# EasyEDA Pro project YuriPre2.0.eprj

# Schematic Schematic1

## Sheets
1 P1: Create Date: 2022-05-23; Project Name: YuriPre2.0; Schematic Name: Schematic1; Update Date: 2022-05-24
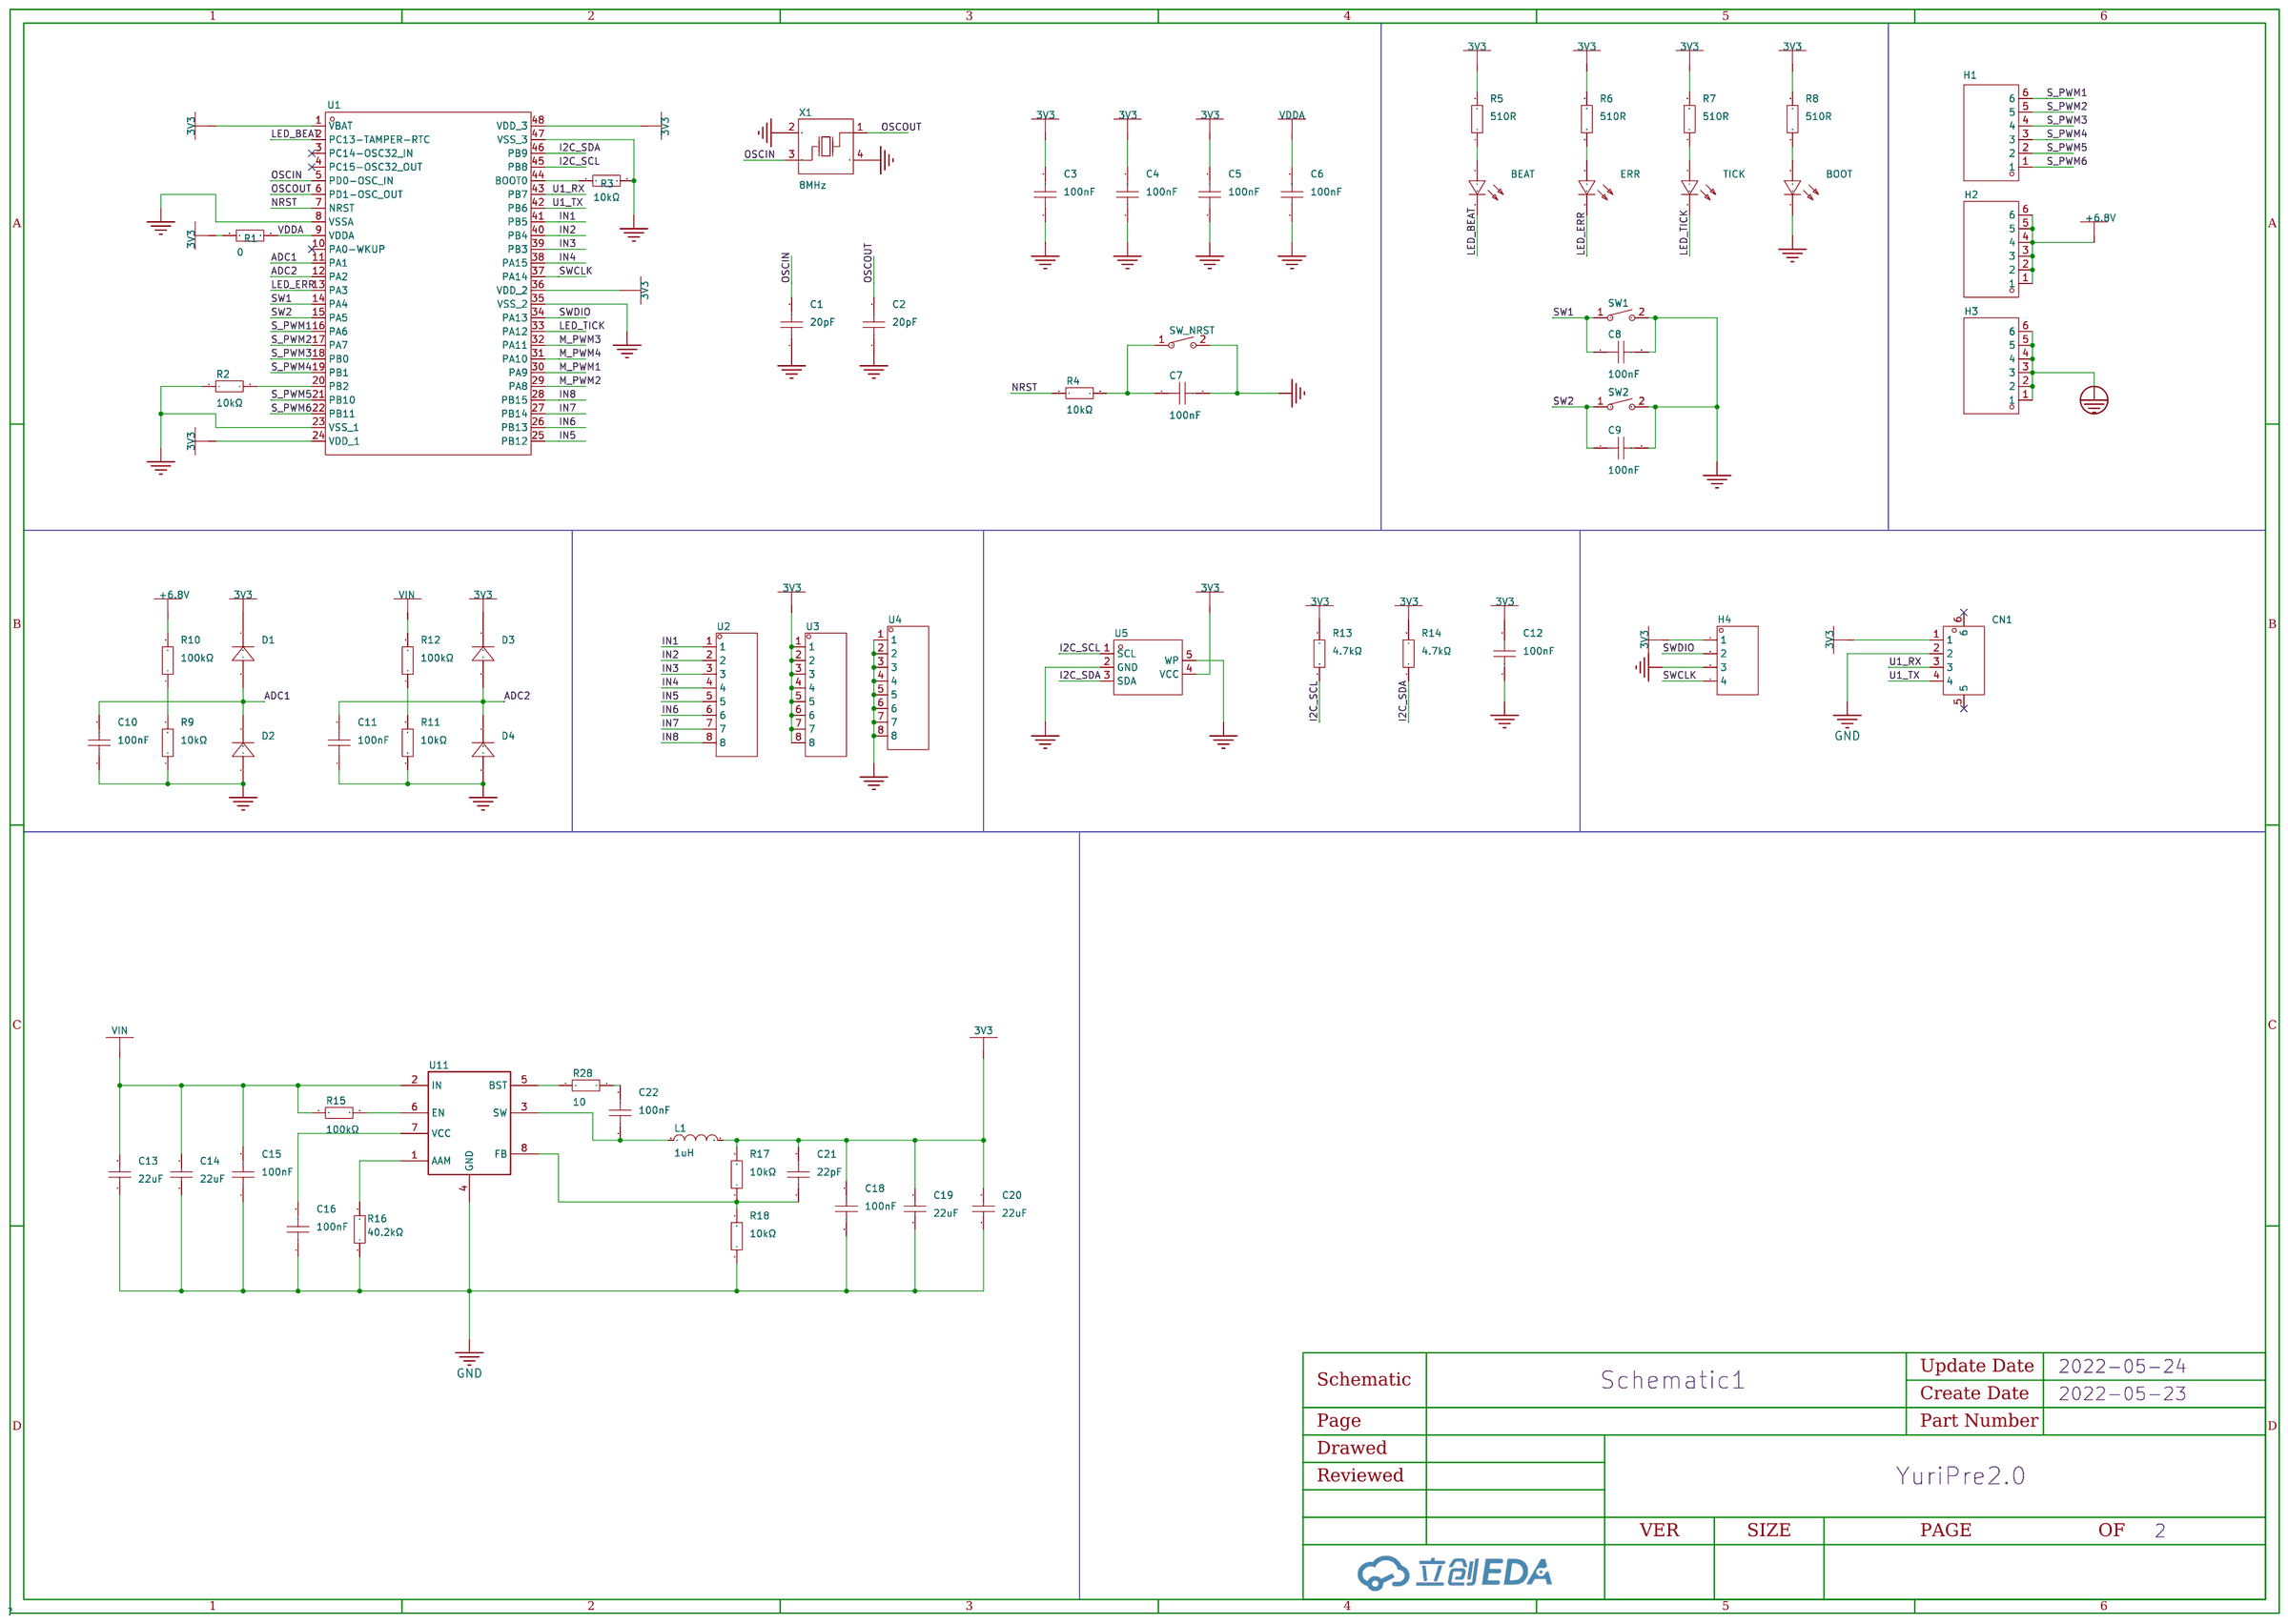
[diagram p0: P1]
2 P2: Create Date: 2022-05-24; Page Name: P2
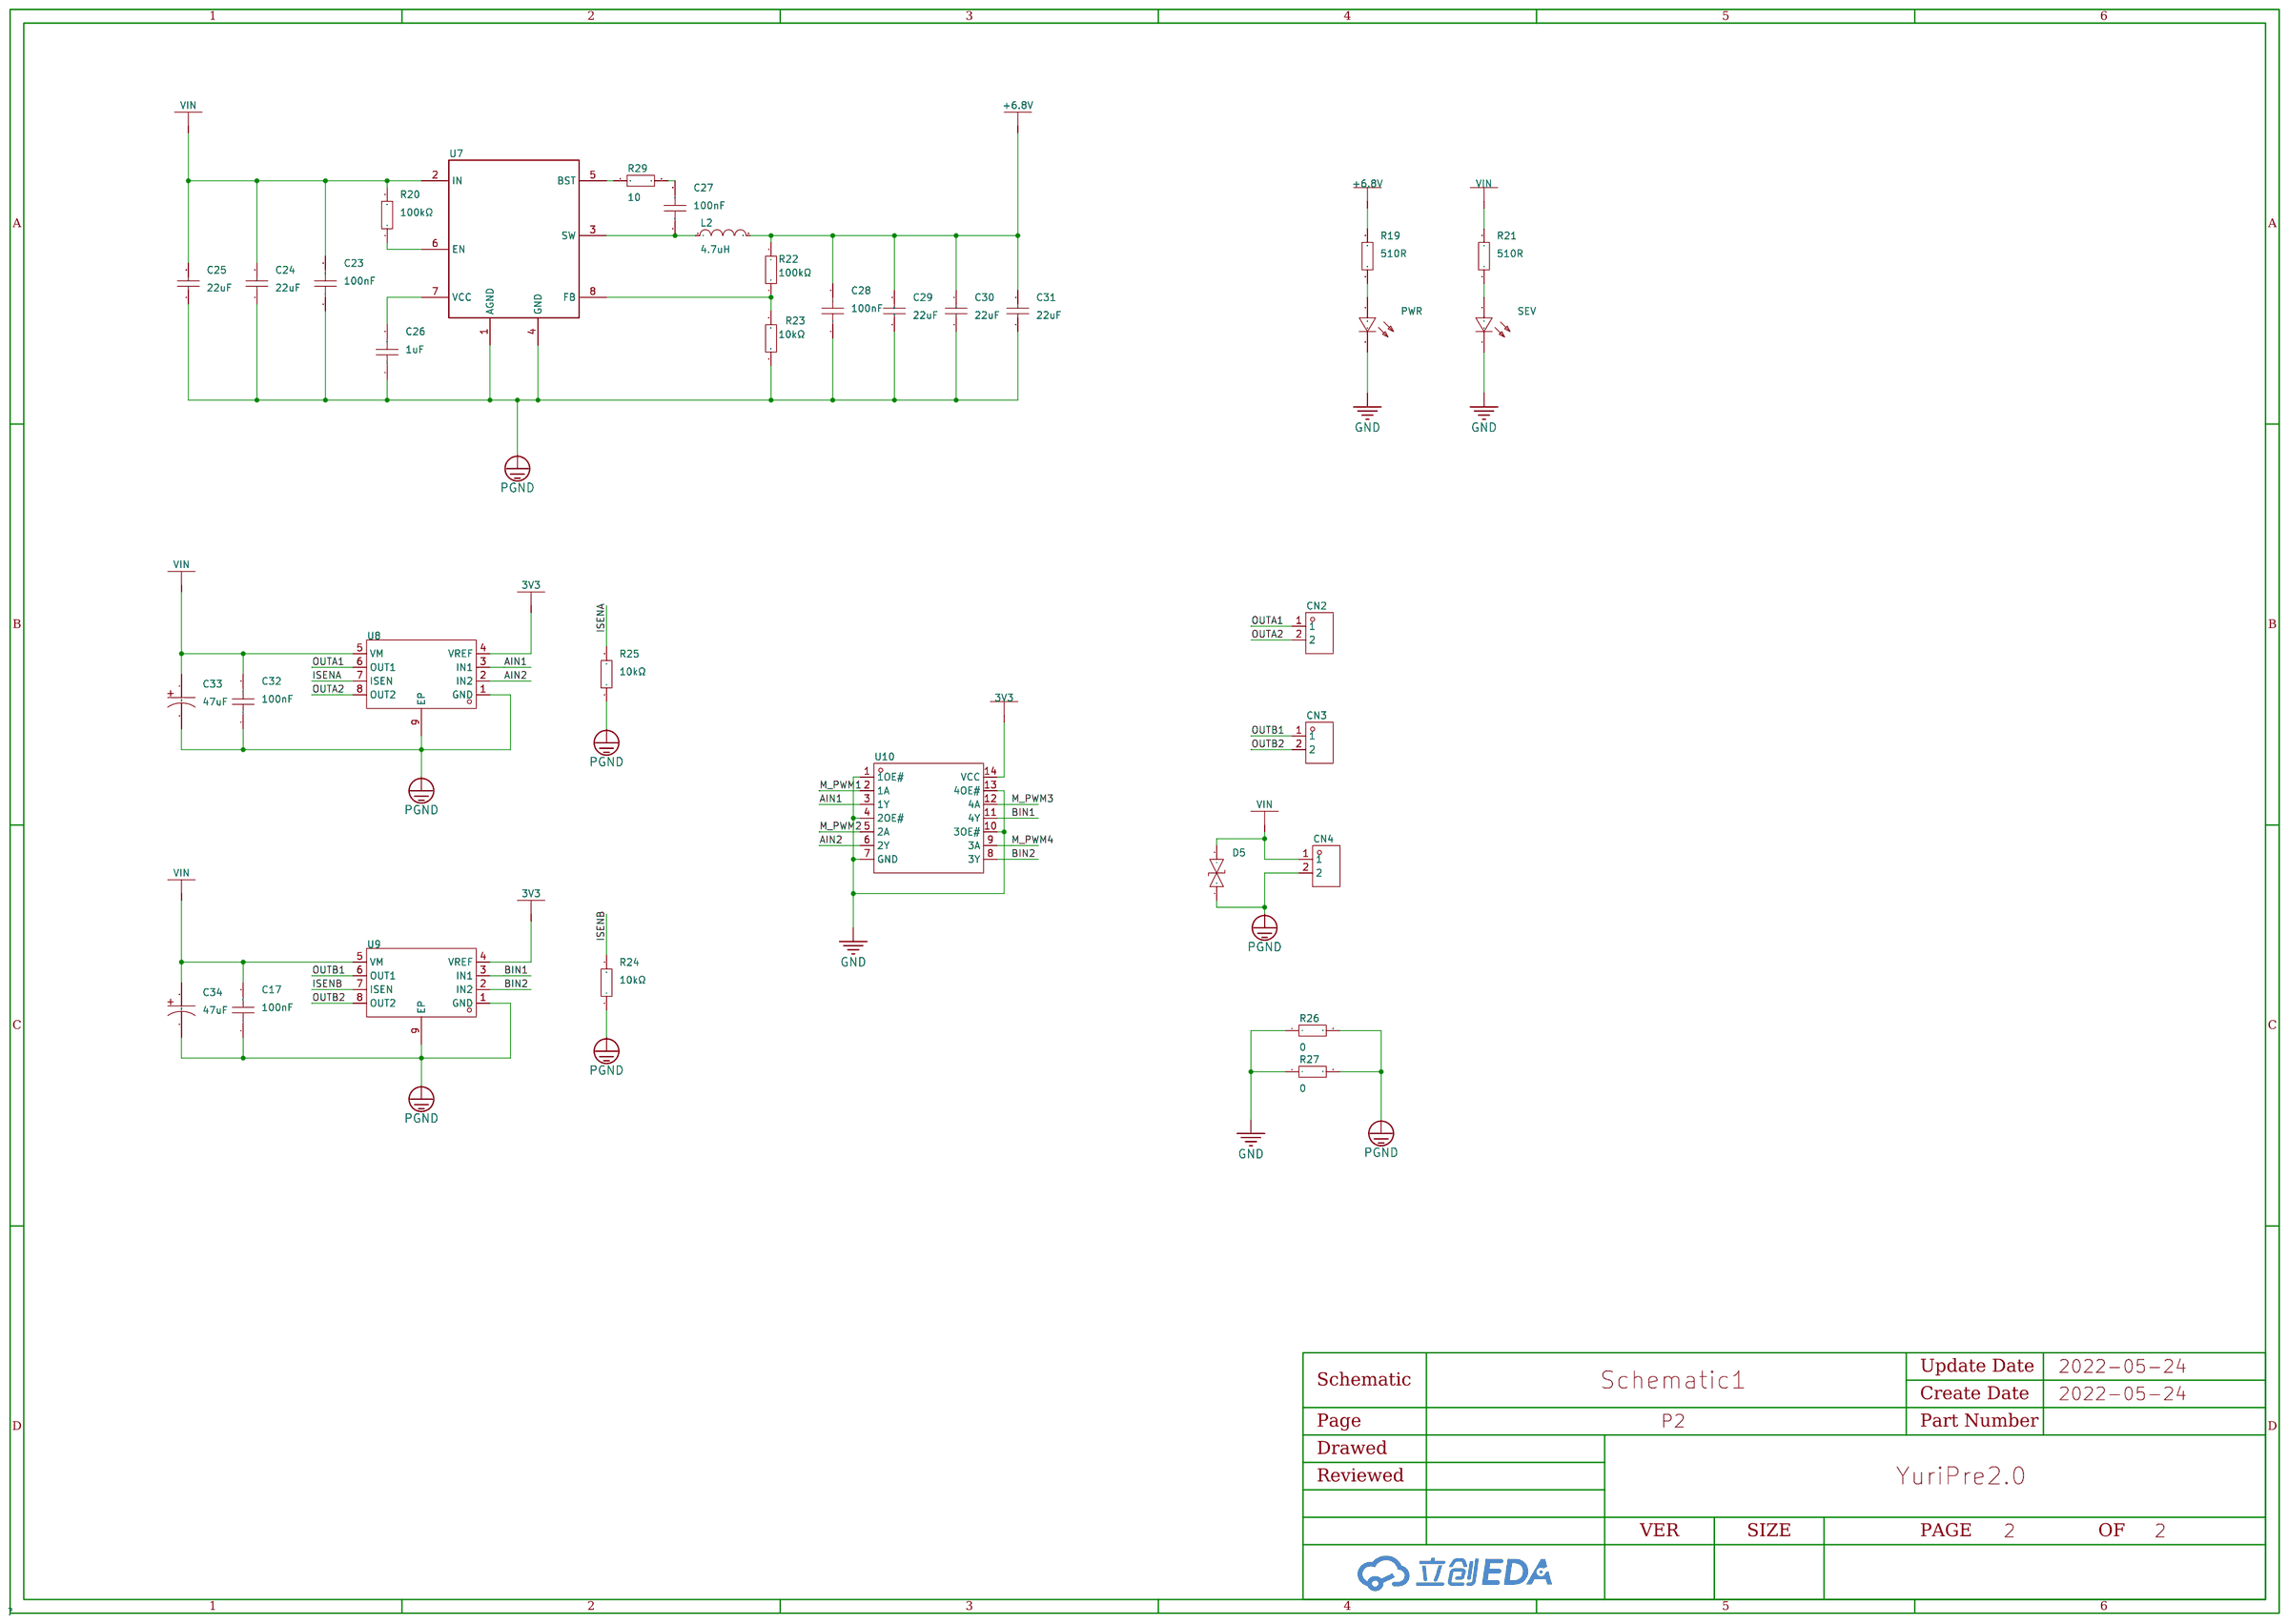
[diagram p1: P2]

## Parts
sheet P1
BEAT  -  [LED0603-R-RD]
BOOT  -  [LED0603-R-RD]
C1  20pF  [C0402]
C2  20pF  [C0402]
C3  100nF  [C0402]
C4  100nF  [C0402]
C5  100nF  [C0402]
C6  100nF  [C0402]
C7  100nF  [C0402]
C8  100nF  [C0402]
C9  100nF  [C0402]
C10  100nF  [C0402]
C11  100nF  [C0402]
C12  100nF  [C0402]
C13  22uF  [C0805]
C14  22uF  [C0805]
C15  100nF  [C0603]
C16  100nF  [C0603]
C18  100nF  [C0603]
C19  22uF  [C0805]
C20  22uF  [C0805]
C21  22pF  [C0402]
C22  100nF  [C0603]
CN1  -  [CONN-SMD_4P-1.25P_1.25T-4P]
D1  -  [SOD-123FL_L2.6-W1.6-LS3.4-R-FD]
D2  -  [SOD-123FL_L2.6-W1.6-LS3.4-R-FD]
D3  -  [SOD-123FL_L2.6-W1.6-LS3.4-R-FD]
D4  -  [SOD-123FL_L2.6-W1.6-LS3.4-R-FD]
ERR  -  [LED0603-R-RD]
H1  -  [HDR-TH_6P-P2.54-V_Z-211-0611-0021-001]
H2  -  [HDR-TH_6P-P2.54-V_Z-211-0611-0021-001]
H3  -  [HDR-TH_6P-P2.54-V_Z-211-0611-0021-001]
H4  -  [HDR-TH_4P-P2.54-V-M]
L1  1uH  [IND-SMD_L2.5-W2.0-1]
R1  0  [R0402]
R2  10kΩ  [R0402]
R3  10kΩ  [R0402]
R4  10kΩ  [R0402]
R5  510R  [R0402]
R6  510R  [R0402]
R7  510R  [R0402]
R8  510R  [R0402]
R9  10kΩ  [R0402]
R10  100kΩ  [R0402]
R11  10kΩ  [R0402]
R12  100kΩ  [R0402]
R13  4.7kΩ  [R0402]
R14  4.7kΩ  [R0402]
R15  100kΩ  [R0402]
R16  40.2kΩ  [R0402]
R17  10kΩ  [R0402]
R18  10kΩ  [R0402]
R28  10  [R0603]
SW1  -  [SW-SMD_L4.0-W2.9-LS5.0]
SW2  -  [SW-SMD_L4.0-W2.9-LS5.0]
SW_NRST  -  [SW-SMD_L4.0-W2.9-LS5.0]
TICK  -  [LED0603-R-RD]
U1  -  [LQFP-48_L7.0-W7.0-P0.50-LS9.0-BL]
U2  -  [HDR-TH_8P-P2.54-V-M]
U3  -  [HDR-TH_8P-P2.54-V-M]
U4  -  [HDR-TH_8P-P2.54-V-M]
U5  -  [SOT-23-5_L3.0-W1.7-P0.95-LS2.8-BL]
U11  -  [TSOT23-8_L2.9-W1.6-P0.65-LS2.8-TL]
X1  8MHz  [CRYSTAL-SMD_4P-L3.2-W2.5-BL]
sheet P2
C17  100nF  [C0603]
C23  100nF  [C0603]
C24  22uF  [C0805]
C25  22uF  [C0805]
C26  1uF  [C0603]
C27  100nF  [C0603]
C28  100nF  [C0603]
C29  22uF  [C0805]
C30  22uF  [C0805]
C31  22uF  [C0805]
C32  100nF  [C0603]
C33  47uF  [CAP-TH_BD5.0-P2.00-D0.8-FD]
C34  47uF  [CAP-TH_BD5.0-P2.00-D0.8-FD]
CN2  -  [CONN-TH_OQ0232510000G]
CN3  -  [CONN-TH_OQ0232510000G]
CN4  -  [CONN-TH_OQ0232510000G]
D5  -  [SOD-123_L2.8-W1.8-LS3.7-BI]
L2  4.7uH  [IND-SMD_L5.7-W5.4]
PWR  -  [LED0603-R-RD]
R19  510R  [R0402]
R20  100kΩ  [R0402]
R21  510R  [R0402]
R22  100kΩ  [R0402]
R23  10kΩ  [R0402]
R24  10kΩ  [R0603]
R25  10kΩ  [R0603]
R26  0  [R0603]
R27  0  [R0603]
R29  10  [R0603]
SEV  -  [LED0603-R-RD]
U7  -  [TSOT23-8_L2.9-W1.6-P0.65-LS2.8-TL]
U8  -  [SOP-8_L4.9-W3.9-P1.27-LS6.0-BL-EP]
U9  -  [SOP-8_L4.9-W3.9-P1.27-LS6.0-BL-EP]
U10  -  [TSSOP-14_L5.0-W4.4-P0.65-LS6.5-BL]

## Library data of the parts
BEAT BOOT ERR PWR SEV TICK = 19-217/GHC-YR1S2/3T: 发光颜色:翠绿;二极管配置:-;透镜颜色:无色透明;主波长:520nm~535nm;峰值波长:518nm;色温:-;光通量(25时):-;测试电流:20mA;正向电压(VF):3.3V;发光强度:285mcd;功率:110mW;发光角度:120°;安装方式:-;工作温度:-40~+85;; LCSC Part Name: 翠绿LED; Supplier Part: C72043; Manufacturer: EVERLIGHT(台湾亿光); Supplier Footprint: 0603; JLCPCB Part Class: Basic Part; Datasheet: https://atta.szlcsc.com/upload/public/pdf/source/20160507/1462613613780.pdf; Supplier: LCSC; Emitted Color: 翠绿; Lens Color: 无色透明; Dominant Wavelength: 520nm~535nm; Peak Wavelength: 518nm; Forward Current: 20mA; Forward Voltage (VF): 3.3V; Luminous Intensity: 285mcd; Power Dissipation: 110mW; Viewing Angle: 120°; Operating Temperature: -40~+85
C1-C12 C21 = FN15X104K250PNG: 容值:100nF;精度:±10%;额定电压:25V;温度系数:X7R;; LCSC Part Name: 100nF ±10% 25V; Supplier Part: C525225; Manufacturer: PSA(信昌电陶); Supplier Footprint: 0402; JLCPCB Part Class: Extended Part; Datasheet: https://atta.szlcsc.com/upload/public/pdf/source/20200506/C436246_4EAA78C9048D88437BAF2CB7B8BE45FD.pdf; Supplier: LCSC; Tolerance: ±10%; Voltage Rated: 25V; Temperature Coefficient: X7R
C13 C14 C19 C20 C24 C25 C29-C31 = CC0805KRX7R9BB104: 容值:100nF;精度:±10%;额定电压:50V;温度系数:X7R;; LCSC Part Name: 100nF ±10% 50V; Supplier Part: C49678; Manufacturer: YAGEO(国巨); Supplier Footprint: 0805; JLCPCB Part Class: Basic Part; Datasheet: https://atta.szlcsc.com/upload/public/pdf/source/20151026/1457707504898.pdf; Supplier: LCSC; Tolerance: ±10%; Voltage Rated: 50V; Temperature Coefficient: X7R
C15-C18 C22 C23 C26-C28 C32 = CC0603KRX7R9BB104: 容值:100nF;精度:±10%;额定电压:50V;温度系数:X7R;; LCSC Part Name: 100nF ±10% 50V; Supplier Part: C14663; Manufacturer: YAGEO(国巨); Supplier Footprint: 0603; JLCPCB Part Class: Basic Part; Datasheet: https://atta.szlcsc.com/upload/public/pdf/source/20170116/1484561234239.pdf; Supplier: LCSC; Tolerance: ±10%; Voltage Rated: 50V; Temperature Coefficient: X7R
CN1 = 1.25T-4P-WT: 参考系列:-;间距:1.25mm;插针结构:1x4P;排数:1;每排PIN数:4;行距:-;安装方式:-;触头材质:磷青铜;; Supplier Part: C125739; Manufacturer: 韩国韩荣; Supplier Footprint: SMD,P=1.25mm; JLCPCB Part Class: Extended Part; Datasheet: https://atta.szlcsc.com/upload/public/pdf/source/20200721/C707315_EB981FF53C07D03444DA83DA11F0005F.pdf; Supplier: LCSC; Pitch: 1.25mm; Pins Structure: 1x4P; Number of Rows: 1; Number of PINs Per Row: 4; Contact Material: 磷青铜
D1-D4 = 1N4148W D1: 二极管配置:独立式;功率:400mW;直流反向耐压(Vr):75V;平均整流电流(Io):150mA;正向压降(Vf):1V@10mA;反向电流(Ir):5A@75V;反向恢复时间(trr):4ns;工作温度:+150@(Tj);; LCSC Part Name: 75V 150mA 4ns; Supplier Part: C129216; Manufacturer: TC(德昌); Supplier Footprint: SOD-123FL; JLCPCB Part Class: Extended Part; Datasheet: https://atta.szlcsc.com/upload/public/pdf/source/20170914/C129216_1505359919918968120.pdf; Supplier: LCSC; Diode Configuration: 独立式; Power Dissipation: 400mW; Reverse Voltage (Vr): 75V; Average Rectified Current (Io): 150mA; Forward Voltage (Vf@If): 1V@10mA; Reverse Leakage Current: 5A@75V; Reverse Recovery Time (trr): 4ns; Operating Temperature: +150@(Tj)
H1-H3 = Z-211-0611-0021-001: 间距:2.54mm;总PIN位数:6;排数:1;插针结构:-;行距:-;安装类型:直插;圆针/方针:-;额定电流:-;额定电压:-;配合针长度:-;塑高:-;触头材质:黄铜;触头镀层:-;颜色:黑色;; LCSC Part Name: 2.54mm; Supplier Part: C190819; Manufacturer: Nextron(台湾正凌); Supplier Footprint: 插件,P=2.54mm; JLCPCB Part Class: Extended Part; Datasheet: https://atta.szlcsc.com/upload/public/pdf/source/20180731/C190819_A681B1380B379CDFC378560BE13D8C8F.pdf; Supplier: LCSC; Pitch: 2.54mm; Number of Pins: 6; Number of Rows: 1; Mounting Type: 直插; Contact Material: 黄铜; Color: 黑色
H4 = B-2100S04P-A110: 间距:2.54mm;总PIN位数:4;排数:1;插针结构:1x4P;行距:-;安装类型:直插;圆针/方针:-;额定电流:-;额定电压:-;配合针长度:6mm;塑高:2.54mm;端接针长度:3mm;触头材质:黄铜;触头镀层:-;工作温度范围:-40~+105;颜色:黑色;; LCSC Part Name: 2.54mm 1x4P; Supplier Part: C124378; Manufacturer: Ckmtw(灿科盟); Supplier Footprint: 插件,P=2.54mm; JLCPCB Part Class: Extended Part; Datasheet: https://atta.szlcsc.com/upload/public/pdf/source/20170821/C124378_1503303307508901532.pdf; Supplier: LCSC; Pitch: 2.54mm; Number of Pins: 4; Number of Rows: 1; Pin Structure: 1x4P; Mounting Type: 直插; Length of Mating Pin: 6mm; Insulation Height: 2.54mm; Length of End Connection Pin: 3mm; Contact Material: 黄铜; Operating Temperature Range: -40~+105; Color: 黑色
L1 = MEKK2520T1R0M: 电感值:-;精度:-;额定电流:-;饱和电流(Isat):-;直流电阻(DCR):-;; LCSC Part Name: 1uH 3.3A; Supplier Part: C2044935; Manufacturer: TAIYO YUDEN(太诱); Supplier Footprint: 1008; JLCPCB Part Class: Extended Part; Datasheet: https://atta.szlcsc.comnull; Supplier: LCSC
R1-R23 = TR0402D10K0Q1025Z: 电阻类型:薄膜电阻;阻值:10kΩ;精度:±0.5%;功率:63mW;温度系数:±25ppm/;最大工作电压:25V;工作温度范围:-55~+155;; LCSC Part Name: 10kΩ ±0.5%; Supplier Part: C149898; Manufacturer: EVER OHMS(天二科技); Supplier Footprint: 0402; JLCPCB Part Class: Extended Part; Datasheet: https://atta.szlcsc.com/upload/public/pdf/source/20190415/C149898_7B08651CD36798FFD08F99A8D38CFCAF.pdf; Supplier: LCSC; Type: 薄膜电阻; Tolerance: ±0.5%; Power(Watts): 63mW; Temperature Coefficient: ±25ppm/; Overload Voltage (Max): 25V; Operating Temperature Range: -55~+155
R24-R29 = TR0603B10K0P0525Z: 电阻类型:薄膜电阻;阻值:10kΩ;精度:±0.1%;功率:100mW;温度系数:±25ppm/;最大工作电压:75V;工作温度范围:-55~+155;; LCSC Part Name: 10kΩ ±0.1% 100mW; Supplier Part: C188363; Manufacturer: EVER OHMS(天二科技); Supplier Footprint: 0603; JLCPCB Part Class: Extended Part; Datasheet: https://atta.szlcsc.com/upload/public/pdf/source/20190415/C188363_433BF05B6FB8F7A0F5F35A3E4390C55A.pdf; Supplier: LCSC; Type: 薄膜电阻; Tolerance: ±0.1%; Power(Watts): 100mW; Temperature Coefficient: ±25ppm/; Overload Voltage (Max): 75V; Operating Temperature Range: -55~+155
SW1 SW2 SW_NRST = TS342A2P-WZ: LCSC Part Name: 轻触开关 3*4*2 两脚小龟不带柱 250gf 黑色塑胶按钮; Supplier Part: C557591; Manufacturer: SHOU HAN(首韩); Supplier Footprint: SMD; JLCPCB Part Class: Extended Part; Datasheet: https://atta.szlcsc.com/upload/public/pdf/source/20200519/C557591_B3A5A21584733303F06306F18577DA8B.pdf; Supplier: LCSC
U1 = STM32F103C8T6: 主频（MAX):72MHz;工作电压:2V ~ 3.6V;; Supplier Part: C8734; Manufacturer: ST(意法半导体); Supplier Footprint: LQFP-48_7x7x05P; JLCPCB Part Class: Basic Part; Datasheet: https://atta.szlcsc.com/upload/public/pdf/source/20140724/1457707174202.pdf; Supplier: LCSC; Speed: 72MHz; Voltage - Supply (Vcc/Vdd): 2V ~ 3.6V; Program Memory Size: 64KB; RAM Size: 20KB; Number of I/O: 37; A/D: 10x12bit; PWM: 13; UART/USART: 3 USART; I2C（SMBUS/PMBUS）: 2; USB Device: 1; CAN: 1
U2-U4 = Z-211-0811-0021-001: 间距:2.54mm;总PIN位数:8;排数:1;插针结构:1x8P;行距:-;安装类型:直插;圆针/方针:方针;额定电流:-;额定电压:-;配合针长度:6mm;塑高:2.5mm;端接针长度:3mm;触头材质:黄铜;触头镀层:-;工作温度范围:-25~+105;颜色:黑色;; LCSC Part Name: 2.54mm 1x8P; Supplier Part: C190820; Manufacturer: Nextron(台湾正凌); Supplier Footprint: 插件,P=2.54mm; JLCPCB Part Class: Extended Part; Datasheet: https://atta.szlcsc.com/upload/public/pdf/source/20180525/C190820_686788E98164DB7F14582F9FE3B4A39E.pdf; Supplier: LCSC; Pitch: 2.54mm; Number of Pins: 8; Number of Rows: 1; Pin Structure: 1x8P; Mounting Type: 直插; Circluar Pins/Square Pins: 方针; Length of Mating Pin: 6mm; Insulation Height: 2.5mm; Length of End Connection Pin: 3mm; Contact Material: 黄铜; Operating Temperature Range: -25~+105; Color: 黑色
U5 = AT24C02M5/TR: 存储器类型:-;存储器容量:-;存储器接口类型:-;工作电压:-;; Supplier Part: C565361; Manufacturer: HGSEMI(华冠); Supplier Footprint: SOT-23-5; JLCPCB Part Class: Extended Part; Datasheet: https://atta.szlcsc.com/upload/public/pdf/source/20210719/C565361_F396BA4F8936B5234E7942D8C3C128A6.pdf; Supplier: LCSC
U11 = MP2318GJ
X1 = X322512MMB4SI: 晶振类型:贴片无源晶振;频率:12MHz;频率公差:±10ppm;频率稳定度:±30ppm;负载电容:10pF;工作温度:-40~+85;; LCSC Part Name: 12MHz ±10ppm 10pF; Supplier Part: C50430; Manufacturer: YXC扬兴科技; Supplier Footprint: SMD3225-4P; JLCPCB Part Class: Extended Part; Datasheet: https://atta.szlcsc.com/upload/public/pdf/source/20210329/C112971_1F611BDC486E193C1706F6D8EB5AA189.pdf; Supplier: LCSC; Crystal Type: 贴片无源晶振; Frequency Tolerance: ±10ppm; Frequency Stability: ±30ppm; Load Capacitance: 10pF; Operating Temperature: -40~+85
C33 C34 = SHL25VB47M5*11_LO: 容值:47uF;精度:±20%;额定电压:25V;电容体直径:5mm;电容体长度:11mm;脚间距:2mm;纹波电流:126mA@120Hz;等效串联电阻:-;工作寿命:2000hrs@85;工作温度:-;; LCSC Part Name: 47uF ±20% 25V; Supplier Part: C371232; Manufacturer: SAMYOUNG(韩国三莹); Supplier Footprint: 径向引线,5x11mm; JLCPCB Part Class: Extended Part; Datasheet: https://atta.szlcsc.com/upload/public/pdf/source/20190227/C371232_74933688364368CB95DF98B5871A0B61.pdf; Supplier: LCSC; Tolerance: ±20%; Rated Voltage: 25V; φD: 5mm; L: 11mm; Lead Spacing: 2mm; Ripple Current: 126mA@120Hz; Lifetime @ Temp: 2000hrs@85
CN2-CN4 = OQ0232510000G: 连接器类型:板端/插座-闭口;间距:3.81mm;排数:1;每排PIN数:2;安装方式:弯针;额定电流:10.5A;额定电压:300V;线规 - AWG:-;线规 - mm?:-;工作温度范围:-40~+115;颜色:绿色;; LCSC Part Name: 3.81mm 排数:1 每排P数:2 弯针; Supplier Part: C967073; Manufacturer: Amphenol; Supplier Footprint: P=3.81mm; JLCPCB Part Class: Extended Part; Datasheet: https://atta.szlcsc.com/upload/public/pdf/source/20201204/C967073_44CB1266B29187072D74C31E4A1678AD.pdf; Supplier: LCSC; Connector Type: 板端/插座-闭口; Pitch: 3.81mm; Number of Rows: 1; Number of PINs Per Row: 2; Mounting Style: 弯针; Current Rating (Max): 10.5A; Voltage Rating (Max): 300V; Operating Temperature Range: -40~+115; Color: 绿色
D5 = SMF18CA: 极性:双向;反向截止电压(Vrwm):18V;击穿电压(最小值):20V;击穿电压(最大值):22.1V;反向漏电流(Ir):5A;峰值脉冲电流(Ipp)@10/1000s:6.8A;最大钳位电压:29.2V;峰值脉冲功率(Ppp)@10/1000s:200W;; LCSC Part Name: 双向 18V 200W null; Supplier Part: C188308; Manufacturer: FMS(台湾美丽微); Supplier Footprint: SOD-123; JLCPCB Part Class: Extended Part; Datasheet: https://atta.szlcsc.com/upload/public/pdf/source/20180504/C188308_54320B4516CBB475199EB099094EE66E.pdf; Supplier: LCSC; Polarity: 双向; Reverse Stand-Off Voltage (Vrwm): 18V; Breakdown Voltage (Min): 20V; Breakdown Voltage (Max): 22.1V; Reverse Leakage Current (Ir): 5A; Peak Pulse Current (Ipp)@10/1000μs: 6.8A; Maximum Clamping Voltage: 29.2V; Peak Pulse Power Dissipation (Ppp)@10/1000μs: 200W
L2 = MHCI05030-4R7M-R8LM: 电感值:4.7uH;精度:±20%;额定电流:-;直流电阻(DCR):-;; LCSC Part Name: 4.7uH ±20%; Supplier Part: C315703; Manufacturer: chilisin(奇力新); Supplier Footprint: SMD; JLCPCB Part Class: Extended Part; Datasheet: https://atta.szlcsc.com/upload/public/pdf/source/20190828/C315703_5E5CD761C4D85DBC466885D839DCDD62.pdf; Supplier: LCSC; Tolerance: ±20%
U7 = MP2236
U8 U9 = AT8870: 直流电机驱动器, 3.6A峰值驱动输出,2A持续输出能力; Supplier Part: C191458; Manufacturer: 嘉兴禾润; Supplier Footprint: SOP-8; JLCPCB Part Class: Extended Part; Datasheet: https://atta.szlcsc.com/upload/public/pdf/source/20180614/C191458_948F4E1C4D0BD7FFC60070E1B02AF2C4.pdf; Supplier: LCSC
U10 = SN74HC125PWR: 逻辑电路的归属系列:74HC;逻辑类型:缓冲器，非反向;元件数:4;每元件位数:1;; Supplier Part: C132994; Manufacturer: TI(德州仪器); Supplier Footprint: TSSOP-14; JLCPCB Part Class: Extended Part; Datasheet: https://atta.szlcsc.com/upload/public/pdf/source/20170930/C132994_1506736365150997346.pdf; Supplier: LCSC; Series: 74HC; Logic Type: 缓冲器，非反向; Number of Elements: 4; Number of Bits per Element: 1; Output Type: 三态; Current - Output High, Low: 7.8mA、7.8mA; Voltage - Supply: 2V ~ 6V; Operating Temperature: -40~+85（TA）

## Nets
3V3: C3.2 C4.2 C5.2 C12.2 C18.2 C19.2 C20.2 C21.2 CN1.1 D1.1(C) D3.1(C) H4.1 L1.2 R1.1 R5.2 R6.2 R7.2 R8.2 R13.2 R14.2 R17.2 U1.1(VBAT) U1.24(VDD_1) U1.36(VDD_2) U1.48(VDD_3) U3.1 U3.2 U3.3 U3.4 U3.5 U3.6 U3.7 U3.8 U5.4(VCC) U8.4(VREF) U9.4(VREF) U10.14(VCC)
+6.8V: C28.2 C29.2 C30.2 C31.2 H2.1 H2.2 H2.3 H2.4 H2.5 H2.6 L2.2 R10.2 R19.2 R22.2
GND: BOOT.2(C) C1.1 C2.1 C3.1 C4.1 C5.1 C6.1 C7.2 C8.2 C9.2 C10.1 C11.1 C12.1 C13.1 C14.1 C15.1 C16.1 C18.1 C19.1 C20.1 CN1.2 D2.2(A) D4.2(A) H4.3 PWR.2(C) R2.1 R3.2 R9.1 R11.1 R16.1 R18.1 R26.1 R27.1 SEV.2(C) SW1.2 SW2.2 SW_NRST.2 U1.8(VSSA) U1.23(VSS_1) U1.35(VSS_2) U1.47(VSS_3) U4.1 U4.2 U4.3 U4.4 U4.5 U4.6 U4.7 U4.8 U5.2(GND) U5.5(WP) U10.1(1OE#) U10.4(2OE#) U10.7(GND) U10.10(3OE#) U10.13(4OE#) U11.4(GND) X1.2(GND) X1.4(GND)
PGND: C17.1 C23.1 C24.1 C25.1 C26.1 C28.1 C29.1 C30.1 C31.1 C32.1 C33.2 C34.2 CN4.2 D5.1(K) H3.1 H3.2 H3.3 H3.4 H3.5 H3.6 R23.1 R24.1 R25.1 R26.2 R27.2 U7.1(AGND) U7.4(GND) U8.1(GND) U8.9(EP) U9.1(GND) U9.9(EP)
VDDA: C6.2 R1.2 U1.9(VDDA)
VIN: C13.2 C14.2 C15.2 C17.2 C23.2 C24.2 C25.2 C32.2 C33.1 C34.1 CN4.1 D5.2(A) R12.2 R15.1 R20.2 R21.2 U7.2(IN) U8.5(VM) U9.5(VM) U11.2(IN)
ADC1: C10.2 D1.2(A) D2.1(C) U1.11(PA1)
ADC2: C11.2 D3.2(A) D4.1(C) U1.12(PA2)
AIN1: U8.3(IN1) U10.3(1Y)
AIN2: U8.2(IN2) U10.6(2Y)
BIN1: U9.3(IN1) U10.11(4Y)
BIN2: U9.2(IN2) U10.8(3Y)
I2C_SCL: R13.1 U1.45(PB8) U5.1(SCL)
I2C_SDA: R14.1 U1.46(PB9) U5.3(SDA)
IN1: U1.41(PB5) U2.1
IN2: U1.40(PB4) U2.2
IN3: U1.39(PB3) U2.3
IN4: U1.38(PA15) U2.4
IN5: U1.25(PB12) U2.5
IN6: U1.26(PB13) U2.6
IN7: U1.27(PB14) U2.7
IN8: U1.28(PB15) U2.8
ISENA: R25.2 U8.7(ISEN)
ISENB: R24.2 U9.7(ISEN)
LED_BEAT: BEAT.2(C) U1.2(PC13-TAMPER-RTC)
LED_ERR: ERR.2(C) U1.13(PA3)
LED_TICK: TICK.2(C) U1.33(PA12)
M_PWM1: U1.30(PA9) U10.2(1A)
M_PWM2: U1.29(PA8) U10.5(2A)
M_PWM3: U1.32(PA11) U10.12(4A)
M_PWM4: U1.31(PA10) U10.9(3A)
NRST: R4.1 U1.7(NRST)
OSCIN: C1.2 U1.5(PD0-OSC_IN) X1.3(OSC2)
OSCOUT: C2.2 U1.6(PD1-OSC_OUT) X1.1(OSC1)
OUTA1: CN2.1 U8.6(OUT1)
OUTA2: CN2.2 U8.8(OUT2)
OUTB1: CN3.1 U9.6(OUT1)
OUTB2: CN3.2 U9.8(OUT2)
S_PWM1: H1.6 U1.16(PA6)
S_PWM2: H1.5 U1.17(PA7)
S_PWM3: H1.4 U1.18(PB0)
S_PWM4: H1.3 U1.19(PB1)
S_PWM5: H1.2 U1.21(PB10)
S_PWM6: H1.1 U1.22(PB11)
SW1: C8.1 SW1.1 U1.14(PA4)
SW2: C9.1 SW2.1 U1.15(PA5)
SWCLK: H4.4 U1.37(PA14)
SWDIO: H4.2 U1.34(PA13)
U1_RX: CN1.3 U1.43(PB7)
U1_TX: CN1.4 U1.42(PB6)
$1N1008: R2.2 U1.20(PB2)
$1N1557: R3.1 U1.44(BOOT0)
$1N3382: C7.1 R4.2 SW_NRST.1
$1N4062: BEAT.1(A) R5.1
$1N4440: ERR.1(A) R6.1
$1N4743: R7.1 TICK.1(A)
$1N5055: BOOT.1(A) R8.1
$1N9457: R9.2 R10.1
$1N10257: R11.2 R12.1
$1N25554: R16.2 U11.1(AAM)
$1N27028: C21.1 R17.1 R18.2 U11.8(FB)
$1N27680: C22.1 L1.1 U11.3(SW)
$1N32458: R15.2 U11.6(EN)
$1N32779: C16.2 U11.7(VCC)
$1N34018: C22.2 R28.2
$1N50933: R28.1 U11.5(BST)
$2N710: C26.2 U7.7(VCC)
$2N823: R20.1 U7.6(EN)
$2N1144: R29.1 U7.5(BST)
$2N1271: C27.2 R29.2
$2N1281: C27.1 L2.1 U7.3(SW)
$2N2681: R22.1 R23.2 U7.8(FB)
$2N17146: PWR.1(A) R19.1
$2N17654: R21.1 SEV.1(A)

Not connected (* = marked no-connect by the designer): CN1 5* 6*; U1 3(PC14-OSC32_IN)* 4(PC15-OSC32_OUT)* 10(PA0-WKUP)*

# Board PCB1
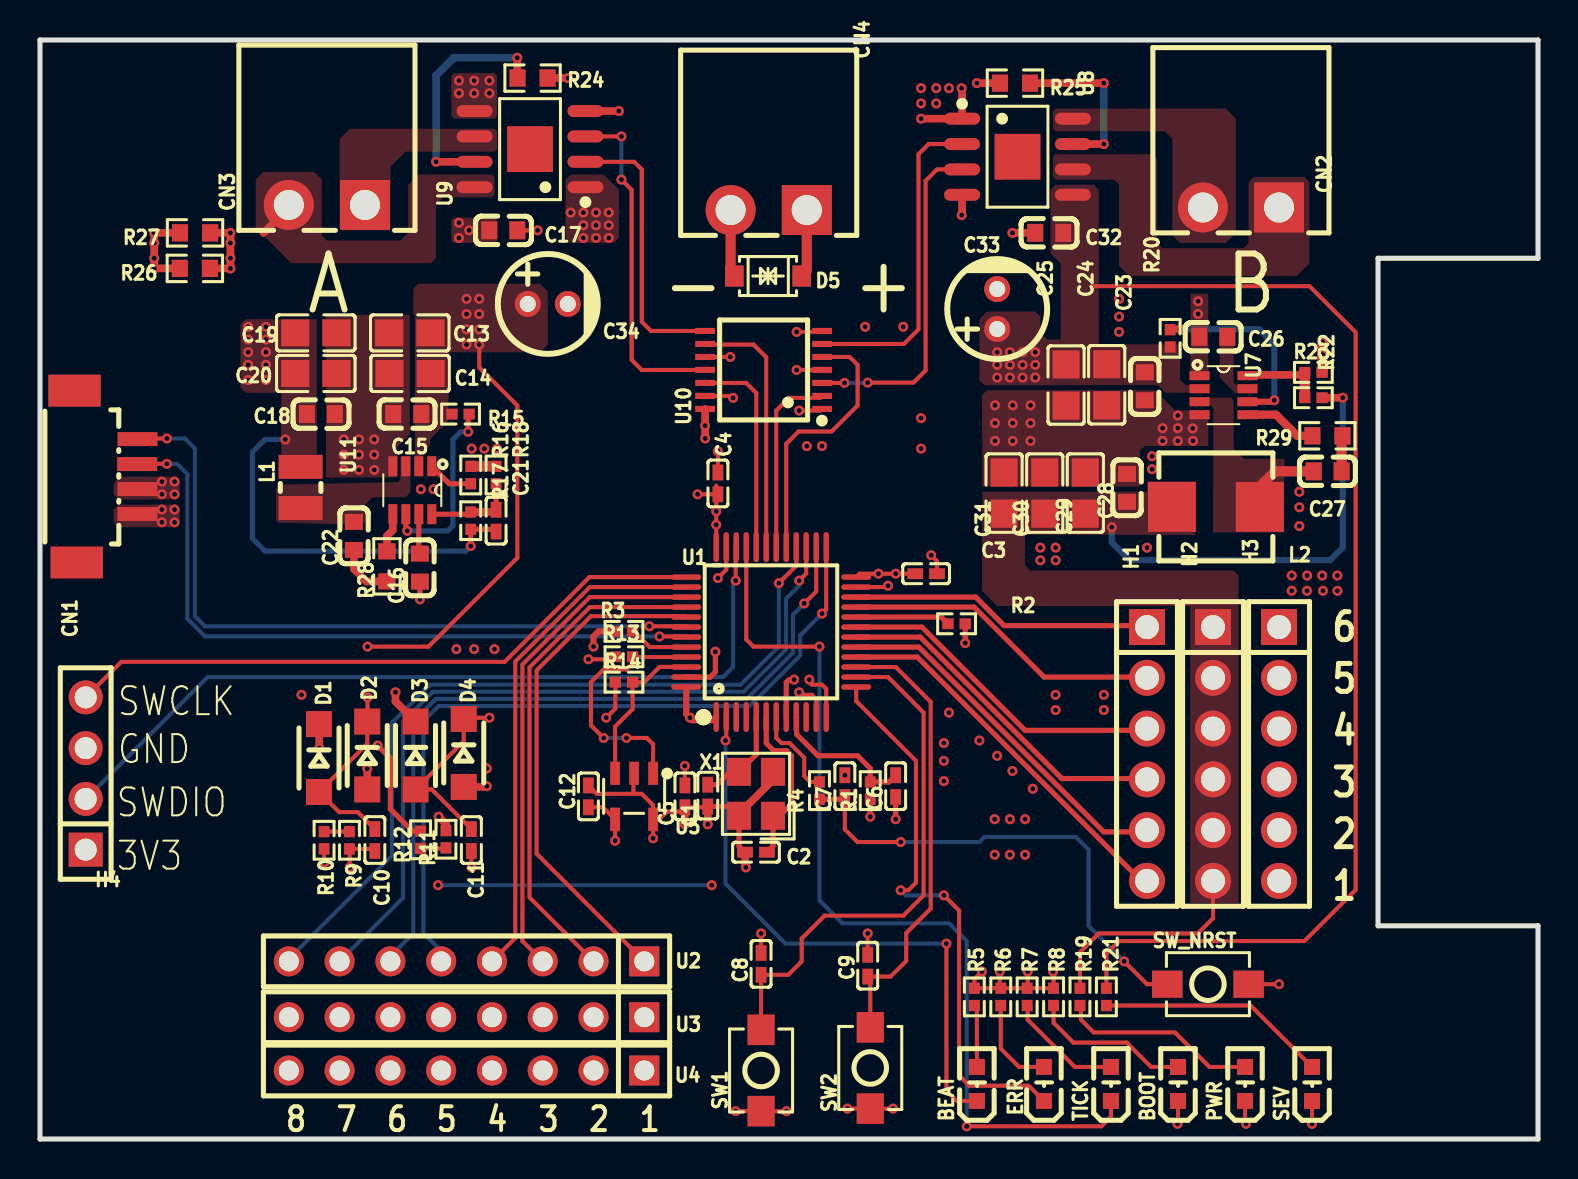
[diagram p2: board, top side]
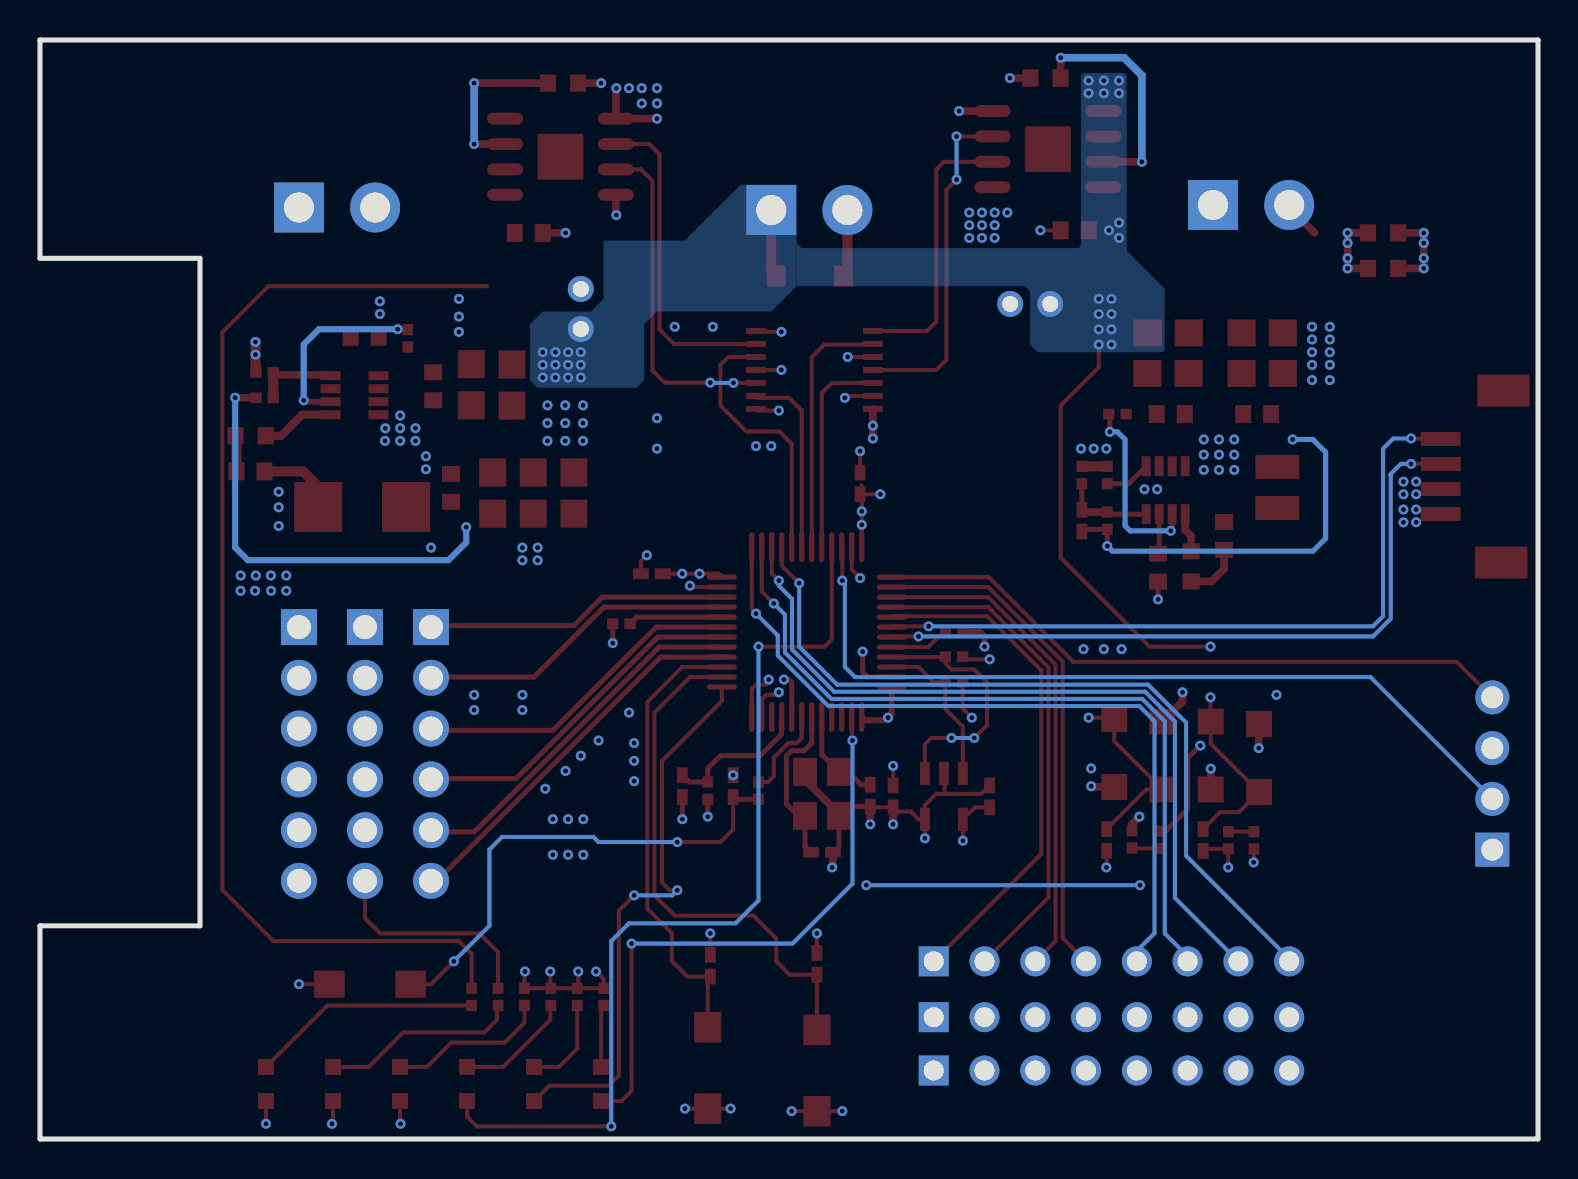
[diagram p3: board, bottom side, seen from below]

Outline 74.93 x 54.99 mm; copper layers: Top Layer, Inner1, Inner2, Bottom Layer. Coordinates in mm from the lower left corner of the outline.
Outline path: 0,54.99 0,0 74.93,0 74.93,10.67 66.93,10.67 66.93,44.07 74.93,44.07 74.93,54.99 0,54.99
Stack: Top Layer 0.035mm / Dielectric1 0.48mm PP er 4.5 / Inner1 0.035mm / Dielectric2 0.48mm FR4 er 4.5 / Inner2 0.035mm / Dielectric3 0.48mm PP er 4.5 / Bottom Layer 0.035mm

## Design rules (mm)
spacing safeClearance (default): track to track 0.152, other pairs 0.152 to 0.3
track width trackWidth (default): min 0.127, default 0.254, max 2.54
differential pair differentialPair (default): width min 0.127, default 0.254, max 2.54; gap min 0.152, default 0.152
via viaSize (default): diameter min 0.45, default 0.5, max 10; hole min 0.2, default 0.25, max 6

## Placement (name value [footprint] x y rotation side)
BEAT  -  [LED0603-R-RD]  46.86 2.76 90 top
BOOT  -  [LED0603-R-RD]  56.92 2.76 90 top
C1  20pF  [C0402]  33.4 17.18 90 top
C2  20pF  [C0402]  35.81 14.35 0 top
C3  100nF  [C0402]  44.32 28.29 180 top
C4  100nF  [C0402]  33.91 32.8 270 top
C5  100nF  [C0402]  32.26 17.14 90 top
C6  100nF  [C0402]  42.8 17.66 90 top
C7  100nF  [C0402]  40.26 17.66 90 top
C8  100nF  [C0402]  36.07 8.76 90 top
C9  100nF  [C0402]  41.4 8.67 90 top
C10  100nF  [C0402]  16.75 14.96 90 top
C11  100nF  [C0402]  21.58 14.96 90 top
C12  100nF  [C0402]  27.43 17.14 270 top
C13  22uF  [C0805]  18.5 40.34 0 top
C14  22uF  [C0805]  18.51 38.3 0 top
C15  100nF  [C0603]  18.37 36.27 0 top
C16  100nF  [C0603]  19 28.59 90 top
C17  100nF  [C0603]  23.18 45.47 180 top
C18  100nF  [C0603]  14.05 36.27 180 top
C19  22uF  [C0805]  13.8 40.34 180 top
C20  22uF  [C0805]  13.8 38.3 180 top
C21  22pF  [C0402]  22.81 30.94 270 top
C22  100nF  [C0603]  15.7 30.18 270 top
C23  100nF  [C0603]  55.26 37.66 90 top
C24  22uF  [C0805]  53.36 37.74 90 top
C25  22uF  [C0805]  51.32 37.73 90 top
C26  1uF  [C0603]  58.69 40.14 0 top
C27  100nF  [C0603]  64.41 33.41 0 top
C28  100nF  [C0603]  54.37 32.58 270 top
C29  22uF  [C0805]  52.29 32.32 270 top
C30  22uF  [C0805]  50.26 32.32 270 top
C31  22uF  [C0805]  48.22 32.32 270 top
C32  100nF  [C0603]  50.48 45.34 0 top
C33  47uF  [CAP-TH_BD5.0-P2.00-D0.8-FD]  47.88 41.53 90 top
C34  47uF  [CAP-TH_BD5.0-P2.00-D0.8-FD]  25.4 41.78 0 top
CN1  -  [CONN-SMD_4P-1.25P_1.25T-4P]  3.3 33.15 90 top
CN2  -  [CONN-TH_OQ0232510000G]  60.07 46.61 180 top
CN3  -  [CONN-TH_OQ0232510000G]  14.35 46.74 180 top
CN4  -  [CONN-TH_OQ0232510000G]  36.45 46.48 180 top
D1  -  [SOD-123FL_L2.6-W1.6-LS3.4-R-FD]  13.96 19.06 90 top
D2  -  [SOD-123FL_L2.6-W1.6-LS3.4-R-FD]  16.37 19.19 90 top
D3  -  [SOD-123FL_L2.6-W1.6-LS3.4-R-FD]  18.78 19.19 90 top
D4  -  [SOD-123FL_L2.6-W1.6-LS3.4-R-FD]  21.2 19.32 90 top
D5  -  [SOD-123_L2.8-W1.8-LS3.7-BI]  36.42 43.18 180 top
ERR  -  [LED0603-R-RD]  50.22 2.76 90 top
H1  -  [HDR-TH_6P-P2.54-V_Z-211-0611-0021-001]  55.37 19.27 270 top
H2  -  [HDR-TH_6P-P2.54-V_Z-211-0611-0021-001]  58.67 19.27 270 top
H3  -  [HDR-TH_6P-P2.54-V_Z-211-0611-0021-001]  61.98 19.27 270 top
H4  -  [HDR-TH_4P-P2.54-V-M]  2.29 18.29 90 top
L1  1uH  [IND-SMD_L2.5-W2.0-1]  13.04 32.6 270 top
L2  4.7uH  [IND-SMD_L5.7-W5.4]  58.82 31.63 180 top
PWR  -  [LED0603-R-RD]  60.27 2.76 90 top
R1  0  [R0402]  41.53 17.43 90 top
R2  10kΩ  [R0402]  45.85 25.78 180 top
R3  10kΩ  [R0402]  29.21 25.4 180 top
R4  10kΩ  [R0402]  38.99 17.43 270 top
R5  510R  [R0402]  46.74 7.11 90 top
R6  510R  [R0402]  48.06 7.11 90 top
R7  510R  [R0402]  49.38 7.11 90 top
R8  510R  [R0402]  50.7 7.11 90 top
R9  10kΩ  [R0402]  15.48 14.95 90 top
R10  100kΩ  [R0402]  14.21 14.95 270 top
R11  10kΩ  [R0402]  20.31 15 270 top
R12  100kΩ  [R0402]  19.04 14.97 90 top
R13  4.7kΩ  [R0402]  29.21 24.13 180 top
R14  4.7kΩ  [R0402]  29.21 22.86 180 top
R15  100kΩ  [R0402]  21.04 36.27 0 top
R16  40.2kΩ  [R0402]  21.54 33.22 270 top
R17  10kΩ  [R0402]  21.54 30.94 270 top
R18  10kΩ  [R0402]  22.81 33.22 270 top
R19  510R  [R0402]  52.02 7.11 90 top
R20  100kΩ  [R0402]  56.53 40.06 270 top
R21  510R  [R0402]  53.34 7.11 90 top
R22  100kΩ  [R0402]  63.69 37.09 0 top
R23  10kΩ  [R0402]  63.69 38.36 180 top
R24  10kΩ  [R0603]  24.64 53.09 180 top
R25  10kΩ  [R0603]  48.77 52.83 0 top
R26  0  [R0603]  7.75 43.56 0 top
R27  0  [R0603]  7.76 45.34 0 top
R28  10  [R0603]  17.35 28.65 270 top
R29  10  [R0603]  64.4 35.19 0 top
SEV  -  [LED0603-R-RD]  63.63 2.76 90 top
SW1  -  [SW-SMD_L4.0-W2.9-LS5.0]  36.07 3.43 270 top
SW2  -  [SW-SMD_L4.0-W2.9-LS5.0]  41.53 3.56 270 top
SW_NRST  -  [SW-SMD_L4.0-W2.9-LS5.0]  58.42 7.75 0 top
TICK  -  [LED0603-R-RD]  53.57 2.76 90 top
U1  -  [LQFP-48_L7.0-W7.0-P0.50-LS9.0-BL]  36.58 25.36 0 top
U2  -  [HDR-TH_8P-P2.54-V-M]  21.34 8.89 180 top
U3  -  [HDR-TH_8P-P2.54-V-M]  21.34 6.1 180 top
U4  -  [HDR-TH_8P-P2.54-V-M]  21.34 3.43 180 top
U5  -  [SOT-23-5_L3.0-W1.7-P0.95-LS2.8-BL]  29.72 17.14 180 top
U7  -  [TSOT23-8_L2.9-W1.6-P0.65-LS2.8-TL]  59.2 37.22 0 top
U8  -  [SOP-8_L4.9-W3.9-P1.27-LS6.0-BL-EP]  48.9 49.15 270 top
U9  -  [SOP-8_L4.9-W3.9-P1.27-LS6.0-BL-EP]  24.51 49.53 90 top
U10  -  [TSSOP-14_L5.0-W4.4-P0.65-LS6.5-BL]  36.19 38.48 90 top
U11  -  [TSOT23-8_L2.9-W1.6-P0.65-LS2.8-TL]  18.62 32.46 270 top
X1  8MHz  [CRYSTAL-SMD_4P-L3.2-W2.5-BL]  35.81 17.27 90 top

## Footprints (pads in the part's own frame, mm; a bottom-side part is the same pattern mirrored in y, then rotated)
C0402
  rect 0.79x0.541 smd: 1(-0.546,0) 2(0.546,0)
C0603
  rect 0.8x0.9 smd: 1(-0.7,0) 2(0.7,0)
C0805
  rect 1.41x1.35 smd: 1(-1.03,0) 2(1.03,0)
CAP-TH_BD5.0-P2.00-D0.8-FD
  round 1.3 hole 0.8: 1(-1.001,0) 2(1.001,0)
CONN-SMD_4P-1.25P_1.25T-4P
  rect 0.701x1.999 smd: 1(-1.875,-1.573) 2(-0.625,-1.573) 3(0.625,-1.557) 4(1.875,-1.575)
  custom 1.601x2.619 smd: 5(4.3,1.575)
  custom 1.601x2.621 smd: 6(-4.3,1.463)
CONN-TH_OQ0232510000G
  rect 2.499x2.499 hole 1.501: 1(-1.905,0)
  round 2.499 hole 1.501: 2(1.905,0)
CRYSTAL-SMD_4P-L3.2-W2.5-BL
  rect 1.4x1.2 smd: 1(-1.1,-0.85) 2(1.1,-0.85) 3(1.1,0.85) 4(-1.1,0.85)
HDR-TH_4P-P2.54-V-M
  rect 1.7x1.7 hole 1.1: 1(-3.81,0)
  round 1.7 hole 1.1: 2(-1.27,0) 3(1.27,0) 4(3.81,0)
HDR-TH_6P-P2.54-V_Z-211-0611-0021-001
  rect 1.801x1.801 hole 1.199: 1(-6.35,0)
  round 1.801 hole 1.199: 2(-3.81,0) 3(-1.27,0) 4(1.27,0) 5(3.81,0) 6(6.35,0)
HDR-TH_8P-P2.54-V-M
  rect 1.501x1.501 hole 1.001: 1(-8.89,0)
  round 1.501 hole 1.001: 2(-6.35,0) 3(-3.81,0) 4(-1.27,0) 5(1.27,0) 6(3.81,0) 7(6.35,0) 8(8.89,0)
IND-SMD_L2.5-W2.0-1
  rect 1.199x2.2 smd: 1(1.028,0) 2(-1.028,0)
IND-SMD_L5.7-W5.4
  rect 2.401x2.499 smd: 1(-2.2,0) 2(2.2,0)
LED0603-R-RD
  rect 0.8x0.8 smd: 1(0.851,0) 2(-0.851,0)
LQFP-48_L7.0-W7.0-P0.50-LS9.0-BL
  oval 0.27x1.5 smd: 1(-2.75,-4.25) 2(-2.25,-4.25) 3(-1.75,-4.25) 4(-1.25,-4.25) 5(-0.75,-4.25) 6(-0.25,-4.25) 7(0.25,-4.25) 8(0.75,-4.25) 9(1.25,-4.25) 10(1.75,-4.25) 11(2.25,-4.25) 12(2.75,-4.25) 25(2.75,4.25) 26(2.25,4.25) 27(1.75,4.25) 28(1.25,4.25) 29(0.75,4.25) 30(0.25,4.25) 31(-0.25,4.25) 32(-0.75,4.25) 33(-1.25,4.25) 34(-1.75,4.25) 35(-2.25,4.25) 36(-2.75,4.25)
  oval 1.5x0.27 smd: 13(4.25,-2.75) 14(4.25,-2.25) 15(4.25,-1.75) 16(4.25,-1.25) 17(4.25,-0.75) 18(4.25,-0.25) 19(4.25,0.25) 20(4.25,0.75) 21(4.25,1.25) 22(4.25,1.75) 23(4.25,2.25) 24(4.25,2.75) 37(-4.25,2.75) 38(-4.25,2.25) 39(-4.25,1.75) 40(-4.25,1.25) 41(-4.25,0.75) 42(-4.25,0.25) 43(-4.25,-0.25) 44(-4.25,-0.75) 45(-4.25,-1.25) 46(-4.25,-1.75) 47(-4.25,-2.25) 48(-4.25,-2.75)
R0402
  rect 0.567x0.541 smd: 1(-0.432,0) 2(0.432,0)
R0603
  rect 0.806x0.864 smd: 1(-0.753,0) 2(0.753,0)
SOD-123_L2.8-W1.8-LS3.7-BI
  rect 0.929x1.059 smd: 1(1.684,0) 2(-1.684,0)
SOD-123FL_L2.6-W1.6-LS3.4-R-FD
  rect 1.3x1.3 smd: 1(1.7,0) 2(-1.7,0)
SOP-8_L4.9-W3.9-P1.27-LS6.0-BL-EP
  oval 0.6x1.8 smd: 1(-1.905,-2.772) 2(-0.635,-2.772) 3(0.635,-2.772) 4(1.905,-2.772) 5(1.905,2.772) 6(0.635,2.772) 7(-0.635,2.772) 8(-1.905,2.772)
  rect 2.29x2.29 smd: 9(0,0)
SOT-23-5_L3.0-W1.7-P0.95-LS2.8-BL
  rect 0.49x1.157 smd: 1(-0.95,-1.153) 2(0,-1.153) 3(0.95,-1.153)
  rect 0.49x1.175 smd: 4(0.95,1.153) 5(-0.95,1.153)
SW-SMD_L4.0-W2.9-LS5.0
  rect 1.53x1.36 smd: 1(-2.035,0) 2(2.035,0)
TSOT23-8_L2.9-W1.6-P0.65-LS2.8-TL
  rect 1.001x0.45 smd: 1(-1.199,0.976) 2(-1.199,0.325) 3(-1.199,-0.325) 4(-1.199,-0.976) 5(1.199,-0.976) 6(1.199,-0.325) 7(1.199,0.325) 8(1.199,0.976)
TSSOP-14_L5.0-W4.4-P0.65-LS6.5-BL
  rect 0.305x0.991 smd: 1(-1.95,-2.926) 2(-1.3,-2.926) 3(-0.65,-2.926) 4(0,-2.926) 5(0.65,-2.926) 6(1.3,-2.926) 7(1.95,-2.926) 8(1.95,2.926) 9(1.3,2.926) 10(0.65,2.926) 11(0,2.926) 12(-0.65,2.926) 13(-1.3,2.926) 14(-1.95,2.926)

## Nets
As in the schematic.

Pads without a net: CN1 5 6; U1 3 4 10

## Via types
v1: diameter 0.5, hole 0.25, Top Layer to Bottom Layer, 260 vias

## Routing (per net, layer and track width the routed paths; a pad name or vN(x,y) marks a point on that pad's centre or on a via; arc(x,y) is an arc through that point)
3V3: length 82.2
  Top Layer w0.203: 33.83,32.17 C4.2 33.83,32.26 ; 33.83,32.17 v1(33.83,31.41) v1(33.83,30.73) U1.36 ; 33.83,32.17 33.83,32.26 ; R14.2 28.78,21.54 v1(28.32,21.08) ; 33.83,32.26 33.83,32.7 ; 33.83,32.26 v1(32.89,32.26) ; R6.2 R7.2 ; R6.2 48.01,7.59 v1(48.01,8.38) ; R6.2 R5.2 46.74,8 v1(47.12,8.38) ; R7.2 R8.2 50.7,8.36 v1(50.67,8.38) ; R7.2 49.4,7.57 v1(49.4,8.38) ; 43.78,28.29 v1(42.8,28.29) v1(41.94,28.29) 41,28.29 U1.24 ; C12.2 28.16,16.6 U5.4 v1(28.77,14.92) 28.7,14.86 ; R13.2 28.65,24 v1(27.43,24) ; C5.2 v1(32.26,18.67)
  Top Layer w0.254: v1(21.54,29.67) R17.2 22.58,30.51 22.81,30.27 ; R1.1 v1(41.53,16.13)
  Top Layer w0.305: U1.48 32.33,21.27 v1(32.51,21.08) 32.64,20.95 33.67,20.95 U1.1
  Top Layer w0.381: D3.1 17.78,21.89 v1(17.78,22.35) ; U8.4 46.12,46.25 v1(46.1,46.23) ; U10.14 v1(33.27,35.69) 33.27,35.06 v1(33.27,35.05) ; v1(13.97,19.56) 13.97,20.75 13.96,20.76 ; U9.4 v1(28.96,51.43)
  Inner2 w0.381: 31.24,36.32 31.24,50.42 30.23,51.43 v1(28.96,51.43) ; v1(46.1,46.23) 45.85,45.97 43.56,45.97 42.29,44.7 42.29,36.7 42.16,36.58
  Bottom Layer w0.254: v1(21.54,29.67) 21.29,29.41 11.26,29.41 10.62,30.05 10.62,34.37 11.26,35 v1(12.27,35)
  vias: v1(6.1,31.5) v1(6.1,30.86) v1(6.73,31.5) v1(6.73,30.86) v1(10.41,40.64) v1(10.41,40) v1(10.41,39.37) v1(10.41,38.73) v1(10.41,37.97) v1(11.3,40.64) v1(11.3,40) v1(11.3,39.37) v1(11.3,38.73) v1(11.3,37.97)
+6.8V: length 81.8
  Top Layer w0.203: H2.6 58.67,11.05 57.91,10.29 52.96,10.29 52.02,9.35 R19.2 ; R10.2 14.21,13.86 v1(14.22,13.84)
  Top Layer w0.381: R22.2 v1(65.17,37.09)
  Inner2 w0.203: v1(14.22,13.84) 14.22,13.21 14.73,12.7 v1(19.91,12.7) ; v1(33.6,12.7) 41.66,12.7 42.67,13.72 51.94,13.72 54.74,10.92 58.12,10.92 58.8,11.6 58.8,12.79 H2.6
  Bottom Layer w0.203: v1(19.91,12.7) v1(33.6,12.7)
  Bottom Layer w0.305: v1(53.61,30.61) 53.61,29.85 54.5,28.96 64.53,28.96 65.17,29.6 v1(65.17,37.09)
GND: length 63.9
  Top Layer w0.203: 56.92,0.76 56.92,0.66 56.9,0.69 56.92,0.76 ; 56.92,0.76 BOOT.2 ; U5.5 30.98,15.99 31.37,16.38 32.04,16.38 C5.1 33.36,16.6 C1.1 ; U5.5 v1(30.67,15.05) 30.61,14.99 ; U5.5 30.67,16.7 30.1,17.27 29.68,17.27 ; 42.67,1.52 v1(42.67,1.52) SW2.2 40.52,1.52 40.51,1.52 v1(40.39,1.52) ; 34.54,39.12 v1(34.53,39.13) U10.10 ; U10.1 39.04,36.45 v1(37.97,36.45) ; U10.7 39.08,40.39 v1(37.85,40.39) ; 60.46,7.75 v1(61.98,7.75) ; v1(34.8,1.4) 36.06,1.4 SW1.2 v1(37.34,1.39) 37.34,1.4 ; C4.1 v1(33.91,34.42) ; U5.2 29.68,18.26 29.68,17.27 ; C12.1 27.85,17.27 29.68,17.27 ; U1.35 34.33,28.48 v1(33.91,28.07) ; PWR.2 60.27,0.71 v1(60.32,0.76) ; C11.1 21.58,13.58 v1(21.59,13.59) ; C8.2 v1(36.07,10.29) ; C9.2 v1(41.4,10.29) ; v1(34.67,37.08) 34.57,37.18 U10.13 ; v1(42.42,27.69) 42.29,27.69 42.22,27.61 U1.23 ; C10.1 16.65,14.52 R9.1 15.49,14.5 v1(15.49,13.59) ; C3.1 44.87,28.92 v1(44.58,29.21) ; U10.4 v1(37.85,38.48) ; SEV.2 v1(63.63,0.76)
  Top Layer w0.254: U1.8 37.33,22.85 37.47,22.99 v1(37.72,22.99) ; C1.1 34.5,16.64 X1.4 34.96,14.65 C2.1 ; 46.23,24.76 v1(46.28,24.82) R2.1 ; C16.1 v1(19,27) ; C6.1 v1(42.8,16) ; U1.47 33.53,23.11 33.78,23.37 v1(33.78,24.38)
  Top Layer w0.305: v1(27.69,24.64) 27.69,25.15 27.94,25.4 R3.2
  Top Layer w0.381: D4.2 22.32,17.62 v1(22.35,17.65) ; 16.38,18.54 v1(16.37,18.53) D2.2 ; C5.1 v1(32.26,15.75) ; C2.1 35.27,13.63 v1(35.31,13.59) ; C1.1 v1(33.4,15.75) ; R27.1 v1(5.72,45.34) v1(5.72,44.83) v1(5.72,44.07) v1(5.72,43.56) R26.1 ; v1(19.94,16.13) 20.31,15.76 R11.1 ; X1.2 36.66,17.97 34.96,16.27 X1.4
  Top Layer w0.508: R18.1 R16.1
  vias: v1(6.1,32.89) v1(6.1,32.26) v1(6.73,32.89) v1(6.73,32.26) v1(13.08,22.22) v1(15.19,35) v1(15.19,34.24) v1(15.19,33.48) v1(15.96,35) v1(15.96,34.24) v1(15.96,33.48) v1(16.72,35) v1(16.72,34.24) v1(16.72,33.48) v1(19.05,32.51) v1(19.69,32.51) v1(20.83,24.51) v1(21.59,34.54) v1(21.72,24.51) v1(22.22,34.54) v1(22.35,18.54) v1(22.73,24.51) v1(22.86,34.54) v1(38.35,34.67) v1(39.12,34.67) v1(40.26,18.2) v1(41.28,40.64) v1(43.18,40.64) v1(44.07,36.07) v1(44.07,34.54) v1(45.21,19.81) v1(45.21,18.92) v1(45.21,17.91) v1(45.47,21.34) v1(46.99,19.94) v1(47.75,16) v1(47.75,14.22) v1(47.88,19.18) v1(48.51,16) v1(48.51,14.22) v1(48.64,18.41) v1(49.28,16) v1(49.28,14.22) v1(49.66,17.53) v1(50.8,22.22) v1(50.8,21.46) v1(53.21,22.22) v1(53.21,21.46) v1(56.9,0.76)
PGND: length 16.4
  Top Layer w0.203: C17.1 v1(24.89,45.47)
  Top Layer w0.381: R27.2 v1(9.53,45.34) v1(9.53,44.83) v1(9.53,44.07) v1(9.53,43.56) 8.52,43.56 8.51,43.57 R26.2 ; v1(44.07,51.05) U8.1 46.12,52.56 v1(46.1,52.58) ; C32.1 v1(48.64,45.34) ; R24.1 v1(26.42,53.09) ; R25.1 v1(46.86,52.83)
  Top Layer w0.508: v1(64.15,39.88) v1(64.15,39.25) 64.15,38.38 R23.1 ; CN4.2 34.54,43.56 34.67,43.43
  vias: v1(26.54,46.35) v1(27.18,46.35) v1(27.18,45.72) v1(27.18,45.08) v1(27.81,46.35) v1(27.81,45.72) v1(27.81,45.08) v1(28.45,46.35) v1(28.45,45.72) v1(28.45,45.08) v1(44.07,52.58) v1(44.07,51.82) v1(44.83,52.58) v1(44.83,51.82) v1(45.47,52.58) v1(47.77,36.71) v1(47.77,35.82) v1(47.77,34.93) v1(48.66,36.71) v1(48.66,35.82) v1(48.66,34.93) v1(49.55,36.71) v1(49.55,35.82) v1(49.55,34.93) v1(50.04,29.59) v1(50.04,28.96) v1(50.8,29.59) v1(50.8,28.96) v1(53.97,42.04) v1(53.97,41.15) v1(53.97,40.39) v1(55.37,29.59) v1(55.63,34.16) v1(55.63,33.51) v1(56.15,35.57) v1(56.15,34.93) v1(56.91,36.2) v1(56.91,35.57) v1(56.91,34.93) v1(57.66,35.56) v1(57.67,34.93) v1(57.93,41.92) v1(57.93,41.28) v1(62.61,28.19) v1(62.61,27.43) v1(62.99,32.38) v1(62.99,31.61) v1(62.99,30.67) v1(63.38,28.19) v1(63.37,27.43) v1(64.13,28.19) v1(64.17,27.43) v1(64.89,28.19) v1(64.9,27.43)
VDDA: length 7.4
  Top Layer w0.254: U1.9 37.85,21.09 37.85,20.25 38.92,19.18 40.89,19.18 41.53,18.54 R1.2 42.46,17.86 42.8,18.2
VIN: length 93.3
  Top Layer w0.203: v1(16.38,24.64) 19.43,24.64 23.88,29.08 23.88,36.7 21.97,38.61 v1(21.97,39.75) ; R21.2 53.34,9.27 53.97,9.91 63.25,9.91 65.81,12.47 65.81,40.36 63.5,42.67 52.58,42.67
  Top Layer w0.254: R12.2 18.63,15.4 17.53,16.51 17.53,19.05 v1(16.89,19.68)
  Top Layer w0.508: CN4.1 38.35,43.43 37.97,43.05
  Inner2 w0.203: v1(16.38,24.64) 15.49,23.75 15.49,21.08 v1(16.89,19.68)
  vias: v1(20.96,52.96) v1(20.96,52.32) v1(20.96,45.85) v1(20.96,45.08) v1(21.34,42.04) v1(21.34,41.27) v1(21.34,40.51) v1(21.34,39.75) v1(21.46,45.47) v1(21.72,52.96) v1(21.72,52.32) v1(21.97,42.04) v1(21.97,41.27) v1(21.97,40.51) v1(22.48,52.96) v1(22.48,52.32) v1(47.88,39.37) v1(47.88,38.73) v1(47.88,38.1) v1(48.51,39.37) v1(48.51,38.73) v1(48.51,38.1) v1(49.15,39.37) v1(49.15,38.73) v1(49.15,38.1) v1(49.78,39.37) v1(49.78,38.73) v1(49.78,38.1)
ADC1: length 33.3
  Top Layer w0.203: v1(16.38,22.1) 16.38,20.9 D2.1 16.37,19.78 D1.2 14.96,16.36 15.9,16.36 C10.2 ; v1(37.97,22.35) 38.1,22.22 38.61,22.22 38.83,22.01 U1.11
  Inner2 w0.203: v1(37.97,22.35) 19.81,22.35 19.17,21.72 16.64,21.72 16.38,21.97 v1(16.38,22.1)
ADC2: length 30
  Top Layer w0.203: C11.2 19.59,17.49 D3.2 21.2,19.9 D4.1 21.26,21.08 v1(22.48,21.08) ; v1(38.48,22.99) 38.48,22.86 38.61,22.73 39.12,22.73 39.33,22.52 U1.12
  Inner2 w0.203: v1(22.48,21.08) 23.11,21.72 38.48,21.72 38.86,22.1 38.86,22.73 38.61,22.73 38.48,22.86 v1(38.48,22.99)
AIN1: length 17.1
  Top Layer w0.203: U8.3 44.87,48.51 44.3,47.94 44.3,38.46 43.69,37.85 v1(41.4,37.85) ; U10.3 v1(40.24,37.83) 40.26,37.85
  Bottom Layer w0.203: 41.53,37.85 41.51,37.83 v1(40.24,37.83)
AIN2: length 16.3
  Top Layer w0.203: U8.2 44.45,49.78 43.94,49.28 43.94,40.51 43.21,39.78 U10.6
BIN1: length 17.1
  Top Layer w0.203: U10.11 30.1,38.48 29.59,38.99 29.59,47.5 v1(29.08,48.01) ; U9.3 v1(29.08,50.16)
  Bottom Layer w0.203: v1(29.08,48.01) v1(29.08,50.16)
BIN2: length 14
  Top Layer w0.203: U9.2 29.72,48.89 30.1,48.51 30.1,40.89 30.56,40.43 U10.8
I2C_SCL: length 12.6
  Top Layer w0.203: 29.64,24 29.64,23.8 29.34,23.49 28.19,23.49 27.56,22.86 27.56,20.7 v1(28.19,20.07) ; 29.64,24 29.75,24.11 U1.45 ; 29.64,24 R13.1 ; v1(29.34,20.07) 30.35,20.07 30.67,19.75 U5.1
  Bottom Layer w0.203: v1(28.19,20.07) v1(29.34,20.07)
I2C_SDA: length 7.9
  Top Layer w0.203: U5.3 28.77,20.64 29.64,21.51 R14.1 30.23,22.86 30.99,23.62 32.32,23.62 U1.46
IN1: length 25.4
  Top Layer w0.203: U1.41 32.28,26.16 27.55,26.16 24.84,23.45 24.84,14.27 U2.1
IN2: length 25.1
  Top Layer w0.203: U2.2 24.49,12.09 24.49,23.6 27.5,26.61 U1.40
IN3: length 24.9
  Top Layer w0.203: U2.3 24.13,9.91 24.13,23.74 27.5,27.11 U1.39
IN4: length 25.6
  Top Layer w0.203: U2.4 23.77,10.06 23.77,23.89 27.5,27.61 U1.38
IN5: length 38.5
  Top Layer w0.203: v1(39.12,26.29) 39.33,26.5 U1.25
  Bottom Layer w0.203: U2.5 20.07,9.41 19.18,10.3 19.18,20.9 19.94,21.67 35.49,21.67 38.02,24.2 38.02,25.2 v1(39.12,26.29)
IN6: length 38.7
  Top Layer w0.203: v1(38.23,26.8) 38.83,27.4 U1.26
  Bottom Layer w0.203: U2.6 17.53,9.14 18.67,10.29 18.67,20.89 19.8,22.02 35.35,22.02 37.67,24.34 37.67,26.24 v1(38.23,26.8)
IN7: length 39.5
  Top Layer w0.203: U1.27 38.33,28.29 v1(37.97,27.94)
  Bottom Layer w0.203: v1(37.97,27.94) 37.97,27.69 37.31,27.03 37.31,24.49 35.2,22.38 19.65,22.38 18.16,20.89 18.16,12.06 U2.7
IN8: length 40.3
  Top Layer w0.203: v1(36.96,27.81) 37.83,28.68 U1.28
  Bottom Layer w0.203: U2.8 12.45,9.02 17.6,14.17 17.6,20.83 19.5,22.73 35.05,22.73 36.96,24.64 v1(36.96,27.81)
ISENA: length 8.3
  Top Layer w0.381: U8.7 v1(53.21,49.78) ; v1(53.21,52.83) 49.53,52.83
  Bottom Layer w0.381: v1(53.21,49.78) v1(53.21,52.83)
ISENB: length 11.7
  Top Layer w0.381: 24,53.09 23.88,53.21 v1(23.88,54.1) ; U9.7 v1(19.81,48.89)
  Bottom Layer w0.381: v1(23.88,54.1) 20.7,54.1 19.81,53.21 v1(19.81,48.89)
LED_BEAT: length 29.7
  Top Layer w0.203: v1(45.34,9.78) 45.34,2.41 45.85,1.9 BEAT.2 ; v1(34.29,19.94) 34.33,19.97 U1.2
  Bottom Layer w0.203: v1(34.29,19.94) 34.29,12.78 37.29,9.78 v1(45.34,9.78)
LED_ERR: length 28.3
  Top Layer w0.203: U1.13 40.83,21.91 43.81,18.92 43.81,12.83 43.43,12.45 v1(43.05,12.45) ; v1(45.21,12.19) 45.97,11.43 45.97,3.17 46.48,2.67 49.45,2.67 ERR.2
  Bottom Layer w0.203: v1(45.21,12.19) 43.31,12.19 v1(43.05,12.45)
LED_TICK: length 46.8
  Top Layer w0.203: TICK.2 53.57,1.12 53.09,0.63 v1(46.35,0.63) ; U1.33 35.33,25 35.69,24.64 v1(38.99,24.64)
  Bottom Layer w0.203: v1(38.99,24.64) 38.99,11.94 40.13,10.79 45.47,10.79 46.35,9.91 v1(46.35,0.63)
M_PWM1: length 9.4
  Top Layer w0.203: U1.30 36.83,36.44 37.47,37.08 39.02,37.08 U10.2
M_PWM2: length 13.5
  Top Layer w0.203: U1.29 37.33,34.79 37.94,35.4 39.59,35.4 40.89,36.7 40.89,38.73 40.5,39.13 U10.5
M_PWM3: length 10.5
  Top Layer w0.203: U1.32 35.83,37.33 35.32,37.83 U10.12
M_PWM4: length 12.8
  Top Layer w0.203: U1.31 36.33,39.11 35.69,39.75 33.3,39.75 U10.9
NRST: length 4.7
  Top Layer w0.203: R4.1 38.52,17.86 38.23,18.16 38.23,19.08 37.5,19.81 37.08,19.81 36.83,20.07 36.83,21.11 U1.7
OSCIN: length 4.9
  Top Layer w0.254: U1.5 35.83,19.23 X1.3 34.5,18.37 33.86,17.73 C1.2
OSCOUT: length 8.4
  Top Layer w0.254: C2.2 36.66,14.65 X1.1 37,16.17 37.59,16.76 37.59,19.18 37.34,19.43 36.7,19.43 36.33,19.81 U1.6
OUTB2: length 1.9
  Top Layer w0.381: CN3.2 12.45,46.61 11.18,45.34
S_PWM1: length 19.2
  Top Layer w0.254: U1.16 43.88,24.11 55.17,12.83 55.37,12.83
S_PWM2: length 18.1
  Top Layer w0.254: U1.17 43.96,24.61 53.21,15.37 55.12,15.37
S_PWM3: length 17.6
  Top Layer w0.254: 55.37,17.78 55.12,18.03 51.11,18.03 44.03,25.11 U1.18
S_PWM4: length 17.2
  Top Layer w0.254: U1.19 44.11,25.61 49.28,20.45 55.5,20.45 55.75,20.19
S_PWM5: length 16
  Top Layer w0.254: U1.21 46.72,26.61 50.23,23.11 55.33,23.11 H1.2
S_PWM6: length 15.2
  Top Layer w0.254: H1.1 55.3,25.69 48.23,25.69 46.8,27.11 U1.22
SW1: length 26.4
  Top Layer w0.203: 40.83,23.11 42.42,23.11 44.2,21.34 44.2,12.19 43.18,11.18 39.24,11.18 38.1,10.03 38.1,8.89 37.43,8.22 C8.1 SW1.1
SW2: length 22.8
  Top Layer w0.203: U1.15 42.81,23.61 44.55,21.87 44.55,11.53 43.33,10.31 43.33,8.91 42.54,8.13 C9.1 41.53,8 SW2.1
SWCLK: length 32.5
  Top Layer w0.203: U1.37 27.48,28.11 23.24,23.88 4.06,23.88 2.29,22.1
SWDIO: length 41.3
  Top Layer w0.203: v1(34.8,27.94) 34.8,29.72
  Bottom Layer w0.203: 2.29,17.02 8.38,23.11 34.16,23.11 34.67,23.62 34.67,27.81 v1(34.8,27.94)
U1_RX: length 35.1
  Top Layer w0.203: U1.43 32.29,25.15 v1(30.99,25.15) ; v1(6.35,33.78) 5.08,33.78
  Bottom Layer w0.203: v1(30.99,25.15) 8.25,25.15 7.37,26.03 7.37,33.15 7.39,33.25 6.86,33.78 v1(6.35,33.78)
U1_TX: length 36.6
  Top Layer w0.203: U1.42 32.29,25.65 v1(30.48,25.65) ; v1(6.35,35.05) 4.57,35.05
  Bottom Layer w0.203: v1(6.35,35.05) 7.24,35.05 7.75,34.54 7.75,26.16 8.25,25.65 v1(30.48,25.65)
$1N1008: length 4.7
  Top Layer w0.254: R2.2 45.08,26.11 U1.20
$1N1557: length 3.1
  Top Layer w0.203: 29.59,25.4 29.72,25.4 30.5,24.61 U1.44
$1N3382: length 24.7
  Top Layer w0.203: SW_NRST.1 55.37,7.75 v1(54.23,8.89) ; v1(43.05,14.86) 40.89,14.86 40.26,15.49 C7.1
  Top Layer w0.254: R4.2 40.15,17 C7.1
  Bottom Layer w0.203: v1(43.05,14.86) 46.99,14.86 47.24,15.11 51.82,15.11 52.45,14.48 52.45,10.67 v1(54.23,8.89)
$1N4062: length 3.1
  Top Layer w0.203: R5.1 46.86,6.55 BEAT.1
$1N4440: length 4.7
  Top Layer w0.203: R6.1 48.06,4.52 48.97,3.61 ERR.1
$1N4743: length 5.9
  Top Layer w0.203: R7.1 49.4,6.65 49.4,5.97 51.76,3.61 TICK.1
$1N5055: length 8
  Top Layer w0.203: BOOT.1 55.57,3.61 54.36,4.83 51.69,4.83 50.7,5.82 R8.1
$1N9457: length 1.3
  Top Layer w0.203: R10.1 R9.2
$1N10257: length 1.3
  Top Layer w0.203: R12.1 20.28,14.54 R11.2
$1N25554: length 2.3
  Top Layer w0.254: 19.6,33.66 20.47,32.79 21.54,32.79
$1N27028: length 4.8
  Top Layer w0.254: 19.6,31.26 21.44,31.26 R17.1 ; 22.81,31.36 22.81,32.79
  Top Layer w0.381: 22.81,31.51 22.67,31.37 R17.1
$1N32458: length 9.4
  Top Layer w0.254: v1(21.42,35.38) 21.42,36.22 R15.2 ; v1(18.37,30.43) 18.35,30.43 18.3,30.49 U11.6
  Bottom Layer w0.254: v1(18.37,30.43) 20.4,30.43 20.66,30.68 20.66,35 21.04,35.38 v1(21.42,35.38)
$1N32779: length 2
  Top Layer w0.254: U11.7 18.95,29.35 C16.2
$1N34018: length 2.9
  Top Layer w0.381: R28.2 16.33,27.9 15.7,28.53 C22.2
$1N50933: length 2
  Top Layer w0.381: U11.5 17.65,30.47 17.35,30.18 R28.1
$2N823: length 9.7
  Top Layer w0.305: 60.4,36.89 61.68,36.89 61.74,36.95 v1(61.74,36.96) ; v1(57.04,40.52) 56.53,40.52
  Bottom Layer w0.305: v1(57.04,40.52) 60.98,40.52 61.74,39.76 v1(61.74,36.96)
$2N1144: length 3.7
  Top Layer w0.406: R29.1 62.88,35.19 61.82,36.24 60.4,36.24
$2N1271: length 1.8
  Top Layer w0.508: R29.2 65.1,35.14 C27.2
$2N1281: length 3
  Top Layer w0.508: C27.1 61.78,33.41 61.02,32.65
$2N2681: length 4.1
  Top Layer w0.381: 60.47,38.23 63.13,38.23 R23.2
  Top Layer w0.508: R23.2 R22.1
$2N17146: length 9.9
  Top Layer w0.203: PWR.1 58.5,3.61 56.77,5.33 52.71,5.33 52.07,5.97 52.07,6.63 R19.1
$2N17654: length 11.6
  Top Layer w0.203: R21.1 60.55,6.68 SEV.1

## Copper pours and planes (outline as drawn; the poured copper is in the pictures)
3V3 on Top Layer: 3.68,31.75 6.98,31.75 6.98,30.61 3.68,30.61
3V3 on Top Layer: 10.03,41.02 12.06,41.02 12.06,37.34 10.03,37.34
3V3 on Top Layer: 12.06,41.02 13.84,41.02 13.84,34.16 12.06,34.16
3V3 on Inner2: 0.89,41.4 22.48,41.4 22.48,36.96 44.07,36.96 43.94,29.97 47.75,26.42 53.09,26.42 53.09,0.76 1.02,0.76
+6.8V on Top Layer: 47.13,32.89 57.78,32.89 57.78,30.23 47.13,30.23
+6.8V on Top Layer: 47.12,30.35 59.94,30.35 59.94,11.81 47.12,11.81
GND on Top Layer: 7.87,55.5 7.87,42.54 11.29,39.13 33.27,39.13 33.27,41.02 33.27,41.02 44.83,41.02 44.83,29.72 47.24,27.3 56.64,27.3 56.64,10.79 75.06,10.79 75.06,-0.13 0,-0.13 0,56.13 0.51,56.13 0.51,55.5
GND on Top Layer: 3.68,33.15 6.98,33.15 6.98,32 3.68,32
GND on Top Layer: 14.31,41.23 18.5,41.23 18.5,33.1 14.31,33.1
GND on Bottom Layer: 7.87,55.5 7.87,42.54 11.29,39.13 33.27,39.13 33.27,41.02 33.27,41.02 44.83,41.02 44.83,29.72 47.24,27.3 56.64,27.3 56.64,10.79 75.06,10.79 75.06,-0.13 0,-0.13 0,56.13 0.51,56.13 0.51,55.5
GND on Inner1: 0.26,54.73 74.67,54.73 74.67,0.26 0.26,0.26
GND on Inner2: 11.83,41.4 22.48,41.4 22.48,27.18 9.65,27.18 9.65,37.34 11.81,37.34
PGND on Top Layer: 57.55,42.3 58.44,42.3 58.44,37.98 57.55,37.98
PGND on Top Layer: 7.43,-10.54 7.43,69.79 76.71,69.79 76.71,-10.54
PGND on Top Layer: 47.12,37.47 58.44,37.47 58.44,32.65 47.12,32.65
PGND on Top Layer: 26.29,48.26 28.96,48.26 28.96,44.83 26.29,44.83
PGND on Bottom Layer: -0.64,58.29 79.38,58.29 79.38,-2.03 -0.64,-2.03
PGND on Inner1: 8,54.73 74.67,54.73 74.67,10.92 8,10.92
PGND on Inner2: 7.87,56.39 7.87,42.54 22.99,42.54 22.99,39.12 33.25,39.12 33.27,39.13 33.27,41.02 33.27,41.02 44.83,41.02 44.83,29.84 47.24,27.43 47.24,27.3 56.64,27.3 56.64,10.79 75.95,10.79 75.95,11.81 75.06,11.81 74.93,30.23 74.93,35.31 75.06,56.39
VIN on Top Layer: 18.67,42.8 25.4,42.8 25.4,39.37 18.67,39.37
VIN on Top Layer: 18.75,41.23 20.53,41.23 20.53,33.22 18.75,33.22
VIN on Top Layer: 50.56,39.76 58.44,39.76 58.44,37.34 50.56,37.34
VIN on Top Layer: 46.99,41.4 51.05,41.4 51.05,37.72 46.99,37.72
VIN on Top Layer: 50.55,47.75 52.96,47.75 52.96,39.62 50.55,39.62
VIN on Top Layer: 20.57,46.1 22.86,46.1 22.86,44.83 20.57,44.83
VIN on Top Layer: 20.57,53.34 22.86,53.34 22.86,51.05 20.57,51.05
VIN on Bottom Layer: 18.67,53.34 37.08,53.34 37.08,39.37 18.67,39.37
VIN on Bottom Layer: 37.08,47.75 50.42,47.75 50.42,37.59 37.08,37.59
OUTA1 on Top Layer: 50.67,49.28 63.5,49.28 63.5,43.18 50.67,43.18
OUTA2 on Top Layer: 50.67,51.56 59.82,51.56 59.82,44.83 50.67,44.83
OUTB1 on Top Layer: 14.99,50.55 22.86,50.55 22.86,45.47 14.99,45.47
OUTB2 on Top Layer: 10.8,48.39 22.73,48.39 22.73,43.81 10.8,43.81
$1N27680 on Top Layer: 11.8,34.14 18.53,34.14 18.53,30.73 11.8,30.73
$2N710 on Top Layer: 59.01,40.54 60.72,40.54 60.72,37.33 59.01,37.33
$2N1281 on Top Layer: 57.55,37.09 62.25,37.09 62.25,30.35 57.55,30.35

## Text on the board
Top Silkscreen Layer: 8 | 7 | 6 | 5 | 4 | 3 | 2 | 1 | SWDIO | 3V3 | SWCLK | GND | A | - | + | B
